# EAGLE design Cansat 2018 V3 (EAGLE 8.6.1)
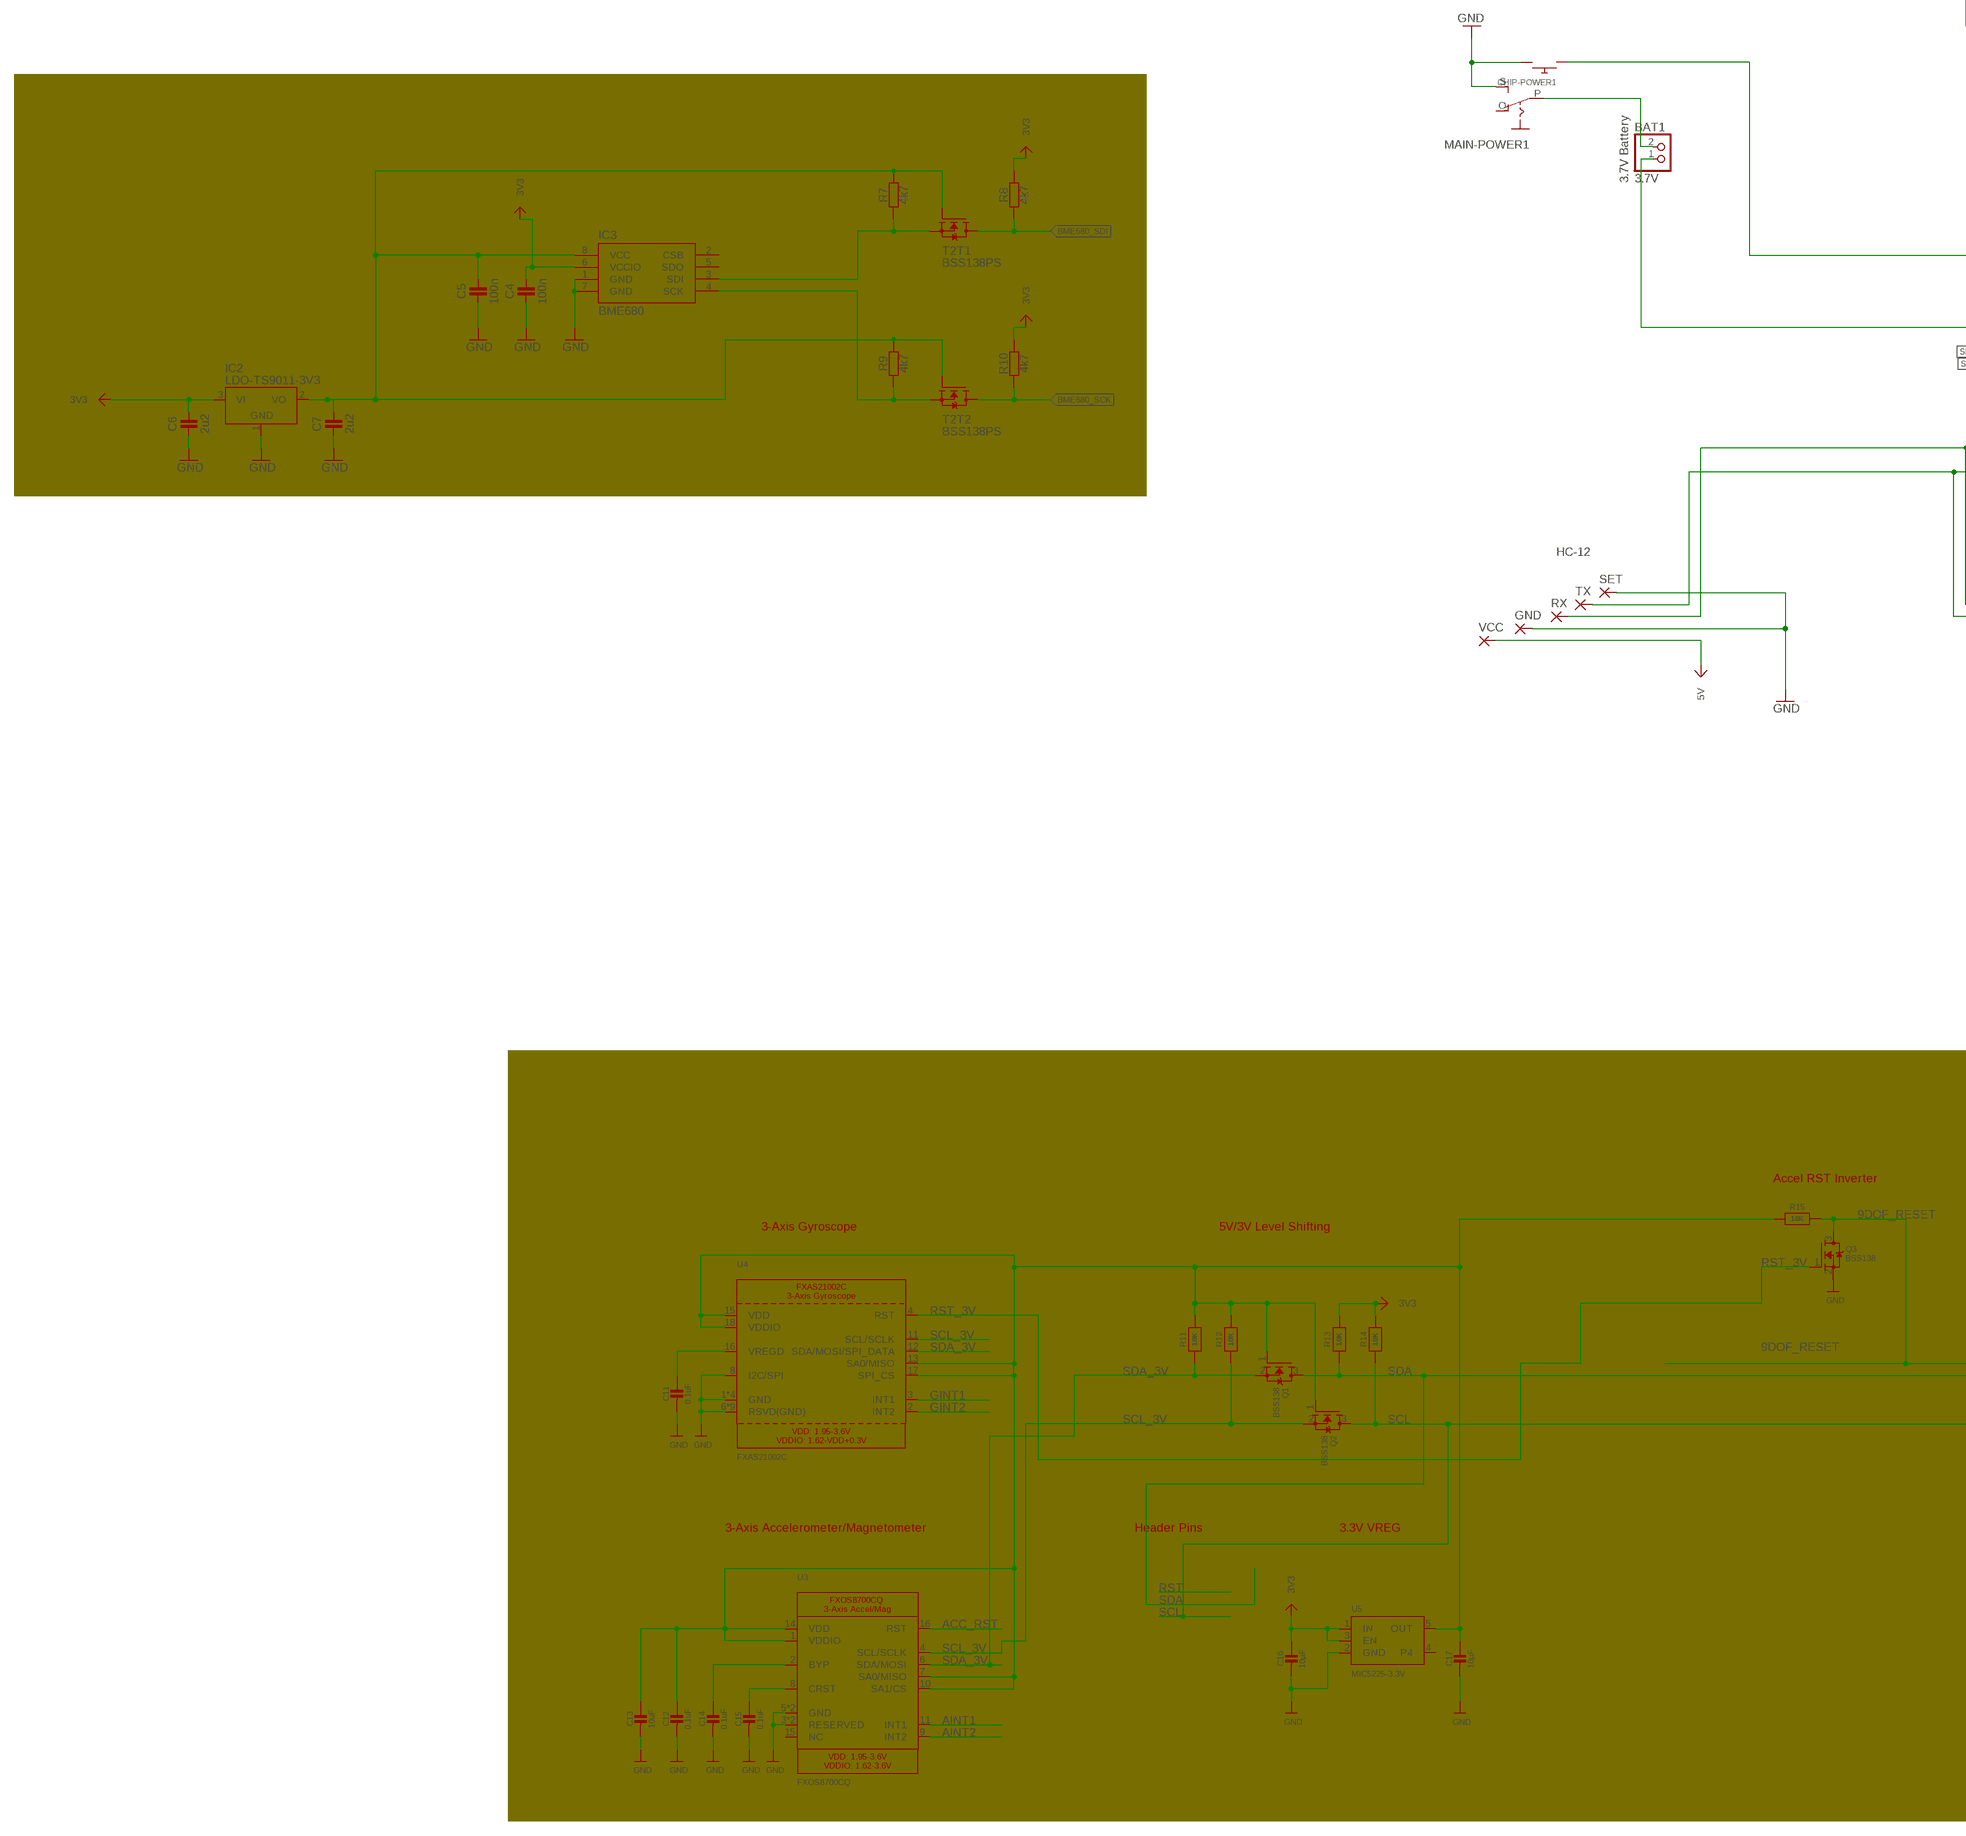
[diagram p0: schematic, sheet 1, part 1 of 3]
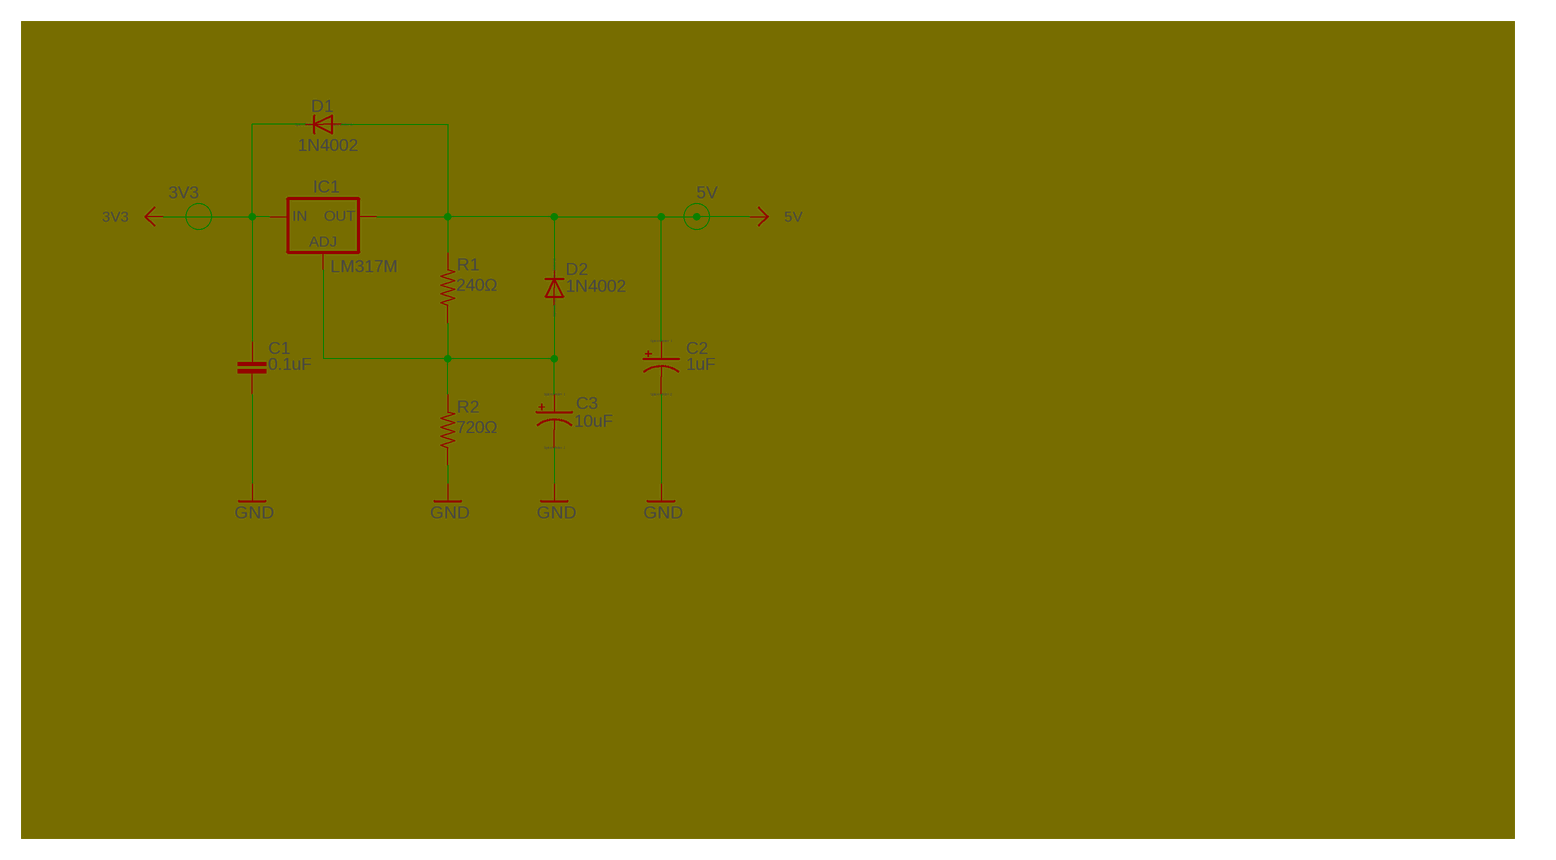
[diagram p1: schematic, sheet 1, part 2 of 3]
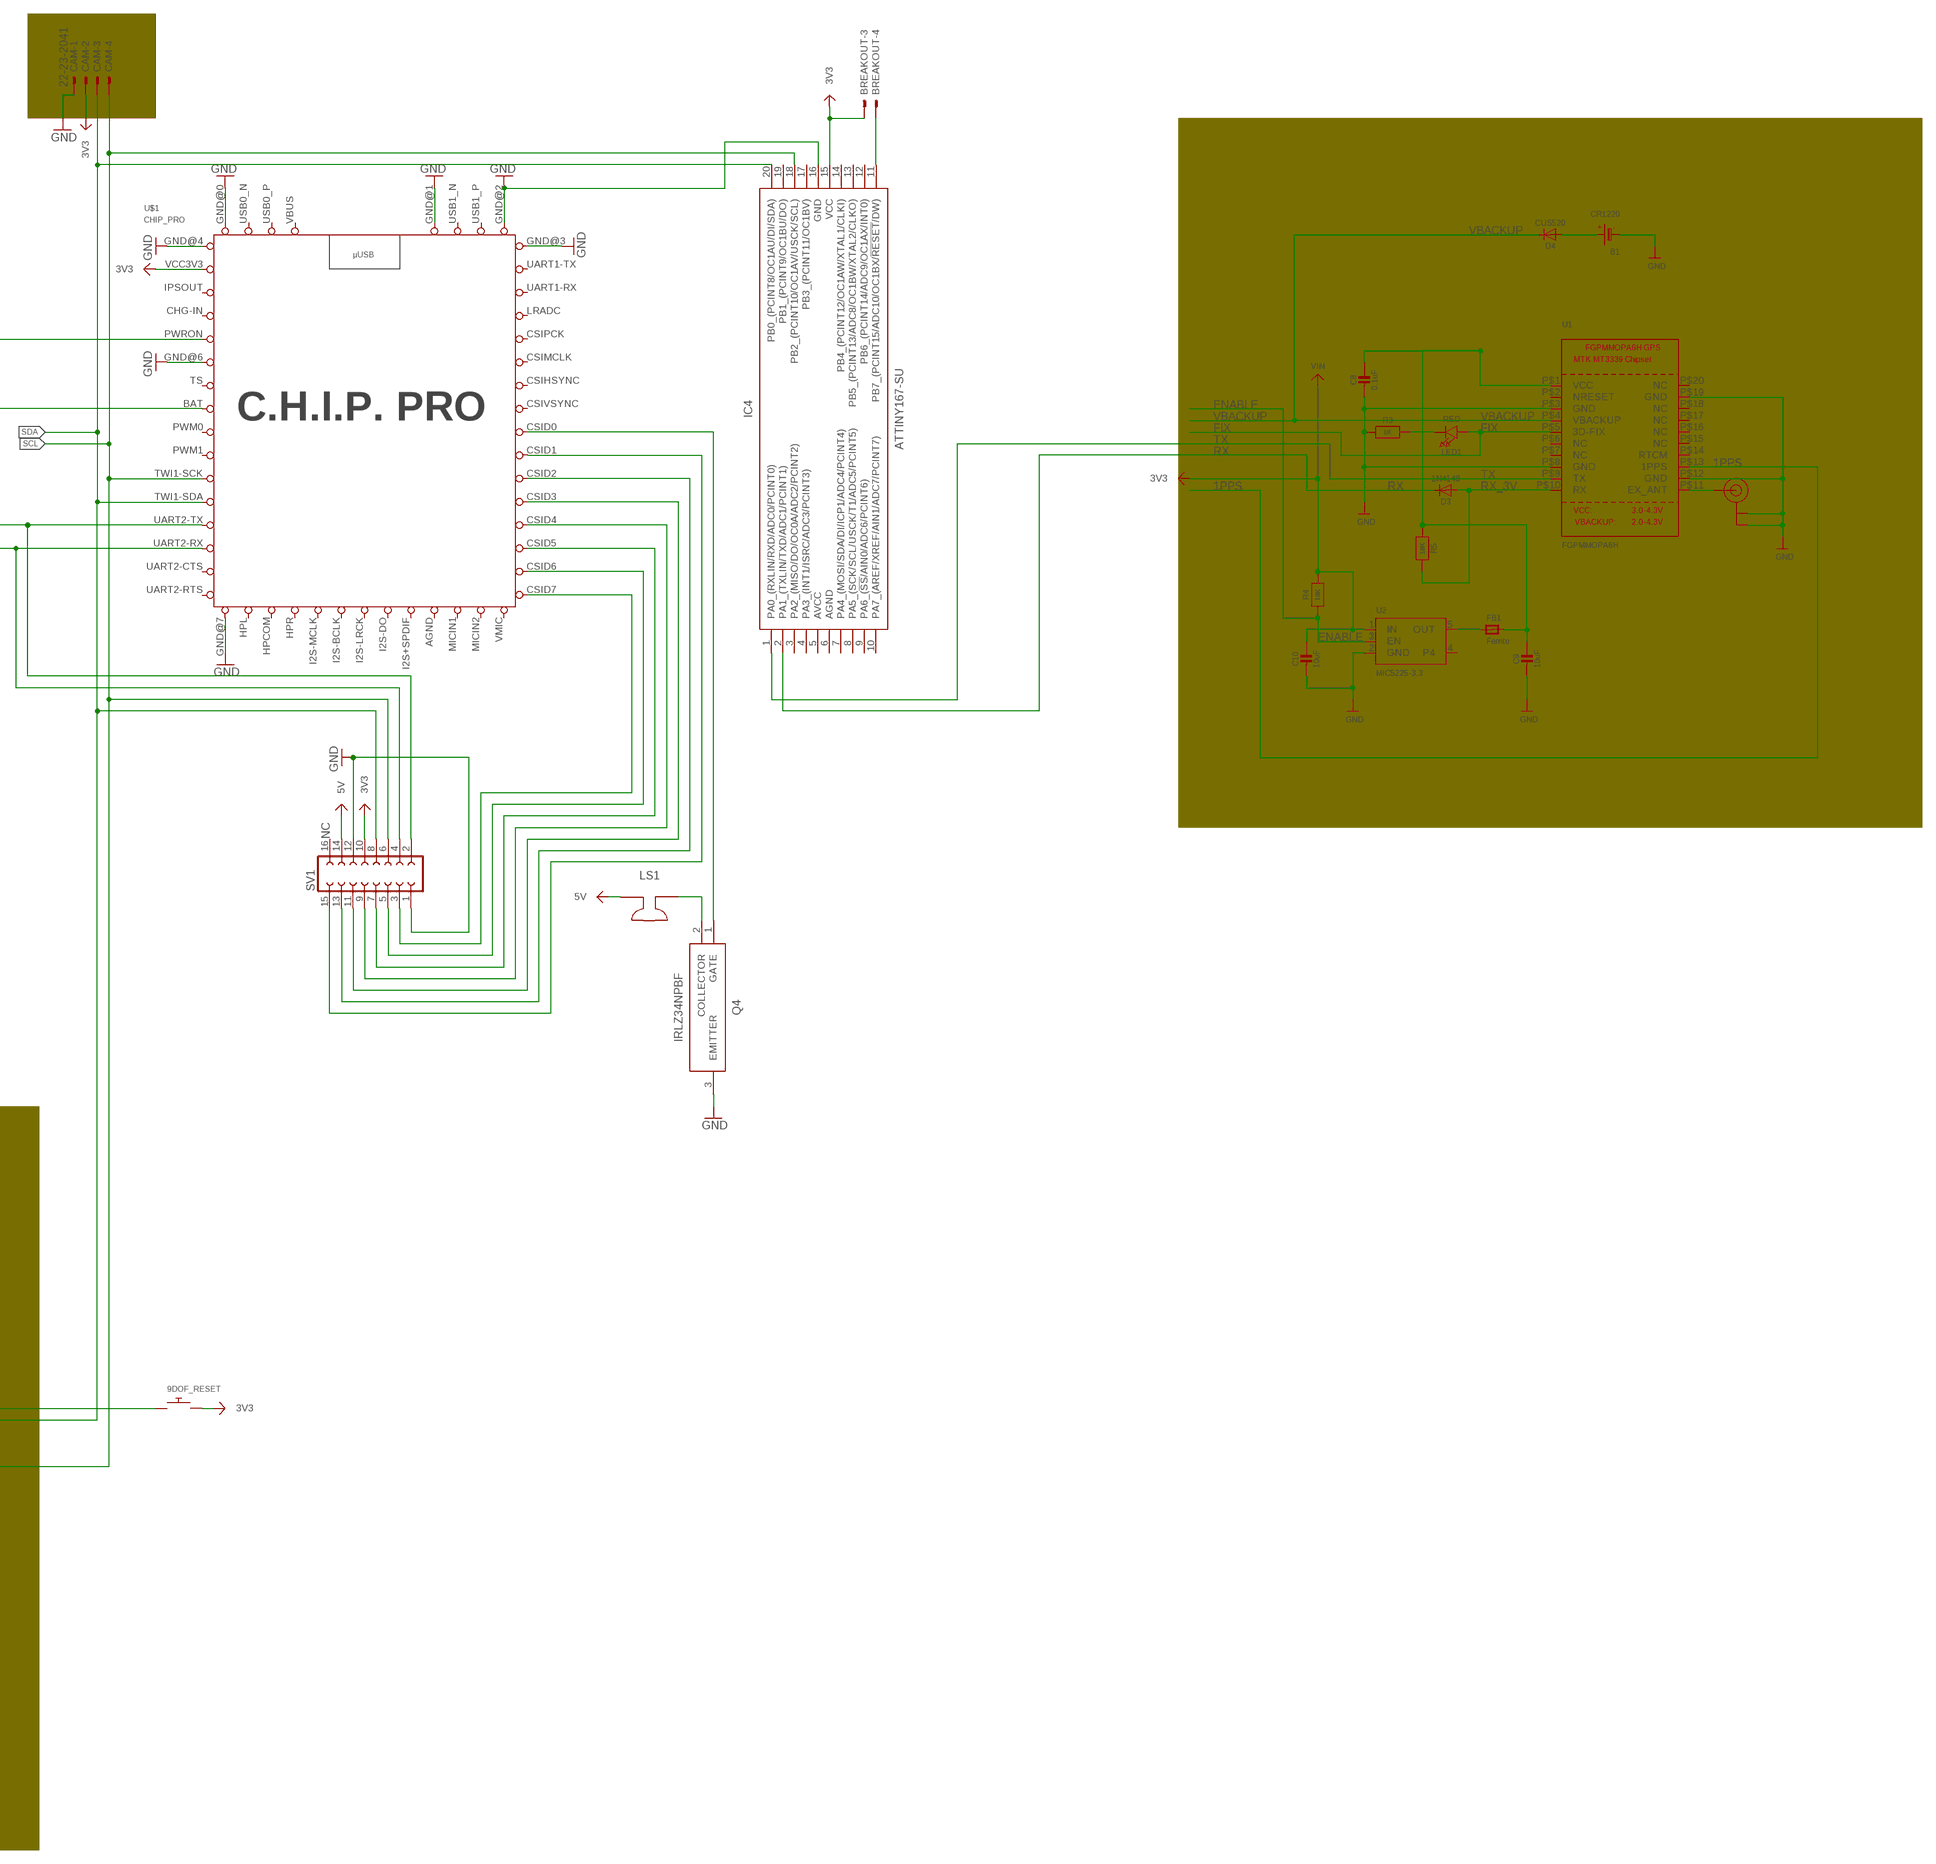
[diagram p2: schematic, sheet 1, part 3 of 3]

## Parts
9DOF_RESET  SWITCH_PUSHBUTTONEVQ-PE  [TACT_PANA-EVQ]
B1  CR1220  BATTERYCR1220_SMT  [CR1220]
BAT1  3.7V  JST_2PIN-THM-RA  [JST-PH-2-THM-RA]
BREAKOUT  22-23-2041  [22-23-2041]
C1  0.1uF  C-EU075-052X106  [C075-052X106]
C2  1uF  CPOL-US085CS-1AR  [085CS_1AR]
C3  10uF  CPOL-US085CS-1AR  [085CS_1AR]
C4  100n  CAPACITOR-0402  [C0402]
C5  100n  CAPACITOR-0402  [C0402]
C6  2u2  CAPACITOR-0402  [C0402]
C7  2u2  CAPACITOR-0402  [C0402]
C8  0.1uF  CAP_CERAMIC0805-NOOUTLINE  [0805-NO]
C9  10uF  CAP_CERAMIC0805-NOOUTLINE  [0805-NO]
C10  10uF  CAP_CERAMIC0805-NOOUTLINE  [0805-NO]
C11  0.1uF  CAP_CERAMIC0805-NOOUTLINE  [0805-NO]
C12  0.1uF  CAP_CERAMIC0805-NOOUTLINE  [0805-NO]
C13  10uF  CAP_CERAMIC0805-NOOUTLINE  [0805-NO]
C14  0.1uF  CAP_CERAMIC0805-NOOUTLINE  [0805-NO]
C15  0.1uF  CAP_CERAMIC0805-NOOUTLINE  [0805-NO]
C16  10µF  CAP_CERAMIC0805-NOOUTLINE  [0805-NO]
C17  10µF  CAP_CERAMIC0805-NOOUTLINE  [0805-NO]
CAM  22-23-2041  [22-23-2041]
CHIP-POWER1  SWITCH_PUSHBUTTONEVQ-PE  [TACT_PANA-EVQ]
D1  1N4002  1N4004  [DO41-10]
D2  1N4002  1N4004  [DO41-10]
D3  1N4148  DIODESOD-323  [SOD-323]
D4  CUS520  DIODESOD-323  [SOD-323]
FB1  Ferrite  FERRITE-0805NO  [0805-NO]
GND  2,15/1,0  [2,15/1,0]
IC1  LM317MBSTT3  [SOT223]
IC2  LDO-TS9011-3V3  [SOT23]
IC3  BME680  [BME680]
IC4  ATTINY167-SU  [SOIC127P1032X265-20N]
LED1  RED  LED0805  [CHIPLED_0805]
LS1  3030161  [CAPPRD650W70D1200H950]
MAIN-POWER1  EG1218S  [EG1218]
Q1  BSS138  MOSFET-NWIDE  [SOT23-WIDE]
Q2  BSS138  MOSFET-NWIDE  [SOT23-WIDE]
Q3  BSS138  MOSFET-NWIDE  [SOT23-WIDE]
Q4  IRLZ34NPBF  [TO254P469X1042X1967-3P]
R1  240Ω  R-US_M0805  [M0805]
R2  720Ω  R-US_M0805  [M0805]
R3  1K  RESISTOR0805_NOOUTLINE  [0805-NO]
R4  10K  RESISTOR0805_NOOUTLINE  [0805-NO]
R5  10K  RESISTOR0805_NOOUTLINE  [0805-NO]
R7  4k7  RESISTOR-0402  [C0402]
R8  4k7  RESISTOR-0402  [C0402]
R9  4k7  RESISTOR-0402  [C0402]
R10  4k7  RESISTOR-0402  [C0402]
R11  10K  RESISTOR0805_NOOUTLINE  [0805-NO]
R12  10K  RESISTOR0805_NOOUTLINE  [0805-NO]
R13  10K  RESISTOR0805_NOOUTLINE  [0805-NO]
R14  10K  RESISTOR0805_NOOUTLINE  [0805-NO]
R15  10K  RESISTOR0805_NOOUTLINE  [0805-NO]
RX  2,15/1,0  [2,15/1,0]
SET  2,15/1,0  [2,15/1,0]
SV1  FE08-2  [FE08-2]
T2  BSS138PS  [SOT363]
TX  2,15/1,0  [2,15/1,0]
U1  FGPMMOPA6H  GPS_FGPMMOPA6H  [FGPMMOPA6H]
U2  MIC5225-3.3  VREG_SOT23-5  [SOT23-5]
U3  FXOS8700CQ  ACCEL_MAG_FXOS8700CQ  [QFN16_3MM_FREESCALE_5X3]
U4  FXAS21002C  GYRO_FXAS21002C  [QFN24_4MM_FREESCALE_7X5]
U5  MIC5225-3.3V  VREG_SOT23-5  [SOT23-5]
U$1  CHIP_PRO  [CHIP_PRO]
U$20  U.FL  [U.FL]
VCC  2,15/1,0  [2,15/1,0]

## Nets
1PPS: U1.P$13(1PPS)
3V3: 9DOF_RESET.P$2 BREAKOUT.3 C1.1 C4.2 C6.2 C10.1 C16.1 CAM.2 D1.C IC1.3(IN) IC2.3(VI) IC3.6(VCCIO) IC4.15(VCC) R4.2 R8.2 R10.2 R13.2 R14.2 SV1.10 U2.1(IN) U5.1(IN) U5.3(EN) U$1.VCC3V3 ; supply symbol labelled VIN
5V: C2.+ D1.A D2.C IC1.4(OUT) LS1.1(+) R1.2 SV1.14 VCC.1(P)
9DOF_RESET: 9DOF_RESET.P$1 Q3.3(D) R15.2
ACC_RST: U3.16(RST)
AINT1: U3.11(INT1)
AINT2: U3.9(INT2)
BME680_LV_SCK: IC3.4(SCK) R9.1 T2.4(T2:S)
BME680_LV_SDI: IC3.3(SDI) R7.1 T2.1(T1:S)
BME680_SCK: R10.1 T2.3(T2:D)
BME680_SDI: R8.1 T2.6(T1:D)
ENABLE: R4.1 U2.3(EN)
FIX: LED1.A U1.P$5(3D-FIX)
GINT1: U4.3(INT1)
GINT2: U4.2(INT2)
GND: B1.- C1.2 C2.- C3.- C4.1 C5.1 C6.1 C7.1 C8.2 C9.2 C10.2 C11.2 C12.2 C13.2 C14.2 C15.2 C16.2 C17.2 CAM.1 CHIP-POWER1.P$2 GND.1(P) IC2.1(GND) IC3.1(GND) IC3.7(GND) IC4.16(GND) MAIN-POWER1.S Q3.2(S) Q4.3(EMITTER) R2.1 R3.1 SET.1(P) SV1.1 SV1.12 U1.P$3(GND) U1.P$8(GND) U1.P$12(GND) U1.P$19(GND) U2.2(GND) U3.3(RESERVED) U3.5(GND) U3.12(GND) U3.13(RESERVED) U4.1(GND) U4.5(GND) U4.6(RSVD(GND)) U4.7(RSVD(GND)) U4.8(I2C/SPI) U4.9(RSVD(GND)) U4.10(RSVD(GND)) U4.14(GND) U4.19(GND) U4.20(RSVD(GND)) U4.21(RSVD(GND)) U4.22(RSVD(GND)) U4.23(RSVD(GND)) U4.24(RSVD(GND)) U5.2(GND) U$1.GND@0(GND) U$1.GND@1(GND) U$1.GND@2(GND) U$1.GND@3(GND) U$1.GND@4(GND) U$1.GND@6(GND) U$1.GND@7(GND) U$20.P$1(GND) U$20.P$2(GND)
N$1: C3.+ D2.A IC1.1(ADJ) R1.1 R2.2
N$2: LED1.C R3.2
N$3: FB1.1 U2.5(OUT)
N$4: SV1.4 TX.1(P) U$1.UART2-RX
N$5: C5.2 C7.2 IC2.2(VO) IC3.8(VCC) R7.2 R9.2 T2.2(T1:G) T2.5(T2:G)
N$6: RX.1(P) SV1.2 U$1.UART2-TX
N$7: B1.+$1(+) B1.+$2(+) D4.A
N$8: C8.1 C9.1 FB1.2 R5.1 U1.P$1(VCC)
N$9: U1.P$11(EX_ANT) U$20.P$3(SIGNAL)
N$10: BREAKOUT.4 IC4.11(PB7_(PCINT15/ADC10/OC1BX/!RESET!/DW))
N$11: C11.1 U4.16(VREGD)
N$12: CHIP-POWER1.P$1 U$1.PWRON
N$14: LS1.2(-) Q4.2(COLLECTOR)
N$15: BAT1.2 MAIN-POWER1.P
N$16: Q4.1(GATE) U$1.CSID0
N$18: SV1.15 U$1.CSID1
N$19: BAT1.1 U$1.BAT
N$20: SV1.13 U$1.CSID2
N$21: SV1.11 U$1.CSID3
N$22: SV1.9 U$1.CSID4
N$23: SV1.7 U$1.CSID5
N$24: C14.1 U3.2(BYP)
N$25: SV1.5 U$1.CSID6
N$26: C15.1 U3.8(CRST)
N$27: SV1.3 U$1.CSID7
OUT: C12.1 C13.1 C17.1 Q1.1(G) Q2.1(G) R11.2 R12.2 R15.1 U3.1(VDDIO) U3.7(SA0/MISO) U3.10(SA1/CS) U3.14(VDD) U4.13(SA0/MISO) U4.15(VDD) U4.17(SPI_CS) U4.18(VDDIO) U5.5(OUT)
RST_3V: Q3.1(G) U4.4(RST)
RX: D3.C IC4.2(PA1_(TXLIN/TXD/ADC1/PCINT1))
RX_3V: D3.A R5.2 U1.P$10(RX)
SCL: CAM.4 IC4.18(PB2_(PCINT10/OC1AV/USCK/SCL)) Q2.3(D) R14.1 SV1.6 U$1.TWI1-SCK
SCL_3V: Q2.2(S) R12.1 U3.4(SCL/SCLK) U4.11(SCL/SCLK)
SDA: CAM.3 IC4.20(PB0_(PCINT8/OC1AU/DI/SDA)) Q1.3(D) R13.1 SV1.8 U$1.TWI1-SDA
SDA_3V: Q1.2(S) R11.1 U3.6(SDA/MOSI) U4.12(SDA/MOSI/SPI_DATA)
TX: IC4.1(PA0_(RXLIN/RXD/ADC0/PCINT0)) U1.P$9(TX)
VBACKUP: D4.C U1.P$4(VBACKUP)
Unconnected: BREAKOUT.1 BREAKOUT.2 IC3.2(CSB) IC3.5(SDO) IC4.3(PA2_(MISO/DO/OC0A/ADC2/PCINT2)) IC4.4(PA3_(INT1/ISRC/ADC3/PCINT3)) IC4.5(AVCC) IC4.7(PA4_(MOSI/SDA/DI/ICP1/ADC4/PCINT4)) IC4.8(PA5_(SCK/SCL/USCK/T1/ADC5/PCINT5)) IC4.9(PA6_(!SS!/AIN0/ADC6/PCINT6)) IC4.10(PA7_(AREF/XREF/AIN1/ADC7/PCINT7)) IC4.12(PB6_(PCINT14/ADC9/OC1AX/INT0)) IC4.13(PB5_(PCINT13/ADC8/OC1BW/XTAL2/CLKO)) IC4.14(PB4_(PCINT12/OC1AW/XTAL1/CLKI)) IC4.17(PB3_(PCINT11/OC1BV)) IC4.19(PB1_(PCINT9/OC1BU/DO)) MAIN-POWER1.O SV1.16 U1.P$2(NRESET) U1.P$6(NC) U1.P$7(NC) U1.P$14(RTCM) U1.P$15(NC) U1.P$16(NC) U1.P$17(NC) U1.P$18(NC) U1.P$20(NC) U2.4 U3.15(NC) U5.4 U$1.CSIHSYNC U$1.CSIMCLK U$1.CSIPCK U$1.CSIVSYNC U$1.HPCOM U$1.HPL U$1.HPR U$1.I2S+SPDIF(I2SSPDIF) U$1.I2S-BCLK(I2SBCLK) U$1.I2S-DO(I2SDO) U$1.I2S-LRCK(I2SLRCK) U$1.I2S-MCLK(I2SMCLK) U$1.LRADC U$1.MICIN1 U$1.MICIN2 U$1.PWM0 U$1.PWM1 U$1.TS U$1.UART1-RX U$1.UART1-TX U$1.UART2-CTS U$1.UART2-RTS U$1.USB0_N U$1.USB0_P U$1.USB1_N U$1.USB1_P U$1.VMIC

## Notes on the sheet
- 5V Voltage Regulator
- 3V to 40V DC | 5V, 500mA
- Vref = 1.25V
- Useful Notes
- C3 helps in ripple rejection upto 15dB
- D1 protect the device against input short circuit
- D2 protect against output short circuit for capacitance discharging
- C2 of 1 µF tantalum capacitor on the output helps to improve transient response
- Camera pins
- GPS
- BME680
- 3.7V Battery
- I2C Address
  open   = 0x77
- D1+R3 restrict RX input to 3.3V
- HC-12
- NC
- 9DOF
- Accel RST Inverter
- 3-Axis Gyroscope | 5V/3V Level Shifting
- Address = 0x21
- 3-Axis Accelerometer/Magnetometer | Header Pins | 3.3V VREG
- Address = 0x1F

## Power pins joined to a net without a drawn wire
AGND: IC4.6(AGND) U$1.AGND
CHG-IN: U$1.CHG-IN
IPSOUT: U$1.IPSOUT
VBUS: U$1.VBUS

## Library data of the parts
9DOF_RESET CHIP-POWER1 = adafruit:SWITCH_PUSHBUTTON: Buttons SOFTTOUCHSMD_SJ - Soft touch temporary push button (Super Junk Akihabara) Compatible with SKPMANE010 [Mouser: 688-SKPMAN] C&K_KSS = Digikey: KSS221GLFS
B1 = microbuilder:BATTERY: CR1220 SMT - Digikey: 3001K-ND CD2032 BAT-HLD-001 - Digikey: BAT-HLD-001-ND
BAT1 = adafruit:JST_2PIN: JST 2-Pin Connectors of various flavors SMT-RA (S2B-PH-SM4) 4UConnector #17311 SMT (B2B-PH-SM4) THM-RA (S2B-PH) THM (B2B-PH)
BREAKOUT CAM = con-molex:22-23-2041: .100" (2.54mm) Center Header - 4 Pin; MF: MOLEX; MPN: 22-23-2041; OC_FARNELL: 1462920; OC_NEWARK: 38C0355
C1 = rcl:C-EU: CAPACITOR, European symbol; SPICEPREFIX: C
C2 C3 = resistor:CPOL-US: POLARIZED CAPACITOR, American symbol
C4-C7 = we-rcl:CAPACITOR: Capacitors ...4.7uF @ 6.3V -> 0402 ...10uF @ 16V -> 0603 ...22uF @ 25V -> 0805
C8-C17 = microbuilder:CAP_CERAMIC: Ceramic Capacitors For new designs, use the packages preceded by an '_' character since they are more reliable: The following footprints should be used on most boards: _0402 - Standard footprint for regular board layouts _0603 - Standard footprint for regular board layouts _0805 - Standard footprint for regular board layouts _1206 - Standard footprint for regular board layouts For extremely tight-pitch boards where space is at a premium, the following 'micro-pitch' footprints can be used (smaller pads, no silkscreen outline, etc.): _0402MP - Micro-pitch footprint for very dense/compact boards _0603MP - Micro-pitch footprint for very dense/compact boards _0805MP - Micro-pitch footprint for very dense/compact boards _1206MP - Micro-pitch footprint for very dense/compact boards
D1 D2 = diode:1N4004: DIODE general purpose rectifier, 1 A
D3 D4 = microbuilder:DIODE: Diode SMA Model Volts Amps Type Vf Ir Digikey # Notes SSA34-E3 40V 3A Schottky 480mV @ 3A 200uA @ 40V SSA34-E3/61TGITR-ND CDBA120-G 20V 1A Schottky 500mV @ 1A 500uA @ 20V 641-1014-6-ND REEL MBRA210 10V 2A Schottky 350mV @ 2A 700uA @ 10V MBRA210LT3 SOD-123 Model Volts Amps Type Vf Ir Order # Notes BAT54T1G 30V 200mA Schottky 800mV @ 200mA 2uA @ 25V BAT54T1GOSTR-ND B0530W 30V 500mA Schottky 430mV @ 500mA 130uA @ 30V B0530W-FDICT-ND REEL MBR120 20V 1A Schottky 340mV @ 1A MBR120VLSFT1GOSCT-ND SOD-323 Model Volts Amps Type Vf Ir Order # Notes PMEG2005EJ 20V 500mA Schottky 355mV @ 500mA 568-4110-1-ND ZLLS410 10V 570mA Schottky 380mV @ 570mA ZLLS410CT-ND 1N4148WS 75V 150mA Silicon/Simple 1V 1N4148WSFSCT-ND REEL SOD-523 Model Volts Amps Type Vf Ir Order # Notes BAT54XV2 30V 200mA Schottky 0.8V @ 100mA BAT54XV2CT-ND TB751S 30V 30mA Schottky RB751S-40TE61CT-ND SOT23-R/W (R = Solder Paste/Reflow Ovens, W = Hand-Soldering) Model Volts Amps Type Vf Ir Order # Notes BAT54FILM 40V 300mA Schottky 497-7162-1-ND POWERDI-5 Model Volts Amps Type Vf Ir Order # Notes PDS560 60V 5A Schottky 670mV @ 5A 150uA @ 60V PDS560DICT-ND
FB1 = microbuilder:FERRITE: Ferrite Bead 0603 MMZ1608B121C - 120 Ohm @ 100MHz, 600mA, 0.15 Ohm DC Resistance - Digikey: 445-2164-1-ND BK1608HW121-T - 120 Ohm, 600mA Ferrite Chip - Digikey: 587-1876-2-ND 0805 HZ0805B272R-10 - 2.7K Ohm @ 100MHz, 200mA, 0.8 Ohm DC Resistance - Digikey: 240-2504-1-ND (see also Murata BLM21BD272SN1L) MMZ2012Y152B - 1.5K Ohm @ 100MHz, 500mA, 0.4 Ohm DC Resistance - Digikey: 445-1560-1-ND - Mainly for high frequency (80-400MHz) MMZ2012R102A - 1K Ohm @ 100MHz, 500mA, 0.3 Ohm DC Resistance - Digikey: 445-1555-2-ND - More general purpose (10-200MHz)
GND RX SET TX VCC = wirepad:2,15/1,0: THROUGH-HOLE PAD
IC1 = v-reg:LM317?*: 500 mA Adjustable Output Positive Voltage Regulator Source: http://www.onsemi.co.jp .. LM317M-D.PDF; PARTNUMBER: LM317M
IC2 = we-power:LDO: LDOs TS1117 800mA, Vin max 12V - compatible NCP1117 1A, Vin max 20V TS9011 250mA, Vin max 12V - compatible AP2210 300mA, Vin max 15V TS5204 150mA, Vin max 16V
IC3 = we-sensor:BME680: Bosch BME280 Humidity, Pressure, Air Quality Sensor
IC4 = SamacSys_Parts:ATTINY167-SU: Atmel ATTINY167-SU, 8bit AVR Microcontroller, 20MHz, 16 kB Flash, 20-Pin SOIC <https://componentsearchengine.com/Images/3/ATTINY167-SU.jpg> Source: Datasheet <http://docs-europe.electrocomponents.com/webdocs/0fa2/0900766b80fa26b5.pdf>; DESCRIPTION: Atmel ATTINY167-SU, 8bit AVR Microcontroller, 20MHz, 16 kB Flash, 20-Pin SOIC; HEIGHT: 2.65mm; MANUFACTURER_NAME: Microchip; MANUFACTURER_PART_NUMBER: ATTINY167-SU; RS_PART_NUMBER: 1330967; SUPPLIER_NAME: RS
LED1 = microbuilder:LED: LED 0603 - 0603 Surface Mount Package 2mA: Green LED - Low Power (3.9mcd, 2ma, 1.7Vf) - Digikey: 475-2709-2-ND Orange LED - Low Power (9.8mcd, 2ma, 1.8Vf) - Digikey: 475-1194-2-ND Red LED - Low Power (5mcd, 2ma, 1.8Vf) - Digikey: 475-1195-2-ND Yellow LED - Low Power (7mcd, 2ma, 1.8Vf) - Digikey: 475-1196-2-ND 5mA: Blue LED - Low Power (17mcd, 5ma, 2.9Vf) - Digikey: LNJ937W8CRACT-ND 0805 - 0805 Surface Mount Package 2mA: Red LED (8.8mcd, 2mA, 1.8Vf, Clear) - Low Power [Digikey: 475-2510-1-ND] Green LED (5mcd, 2mA, 1.8Vf, Clear) - Low Power [Digikey: 475-2730-1-ND] Yellow LED (11.3mcd, 2mA, 1.8Vf, Clear) - Low Power [Digikey: 475-2555-1-ND] 20mA: Red LED (104mcd, 20mA, Diffused) - LS R976 [Digikey: 475-1278-6-ND] Red LED (12mcd, 20mA, 2.0Vf, Clear) - APT2012EC [Digikey: 754-1128-1-ND] Green LED (15mcd, 20mA, 2.2Vf, Clear) - APT2012GC [Digikey: 754-1131-1-ND] Orange LED (160mcd, 20mA, 2.1Vf, Clear) - APT2012SECK [Digikey: 754-1130-1-ND] 1206 - 1206 Surface Mount Package Green LED (26mcd, 20mA, Diffused) - LG N971 [Digikey: 475-1407-6-ND] Red LED (15mcd, 20mA, Diffused) - LH N974 [Digikey: 475-1416-6-ND] Cree - Cree High-Power Surface Mount LEDs XPEBWT-L1-0000-00D50 - White 111lm 350mA 2.9Vf 6200K 110° XTEAWT-00-0000-00000LEE3 - White 114lm 350mA 2.85Vf 5000K 115° Everlight - Everlight 45-21 Series Surface Mount LEDs 45-21/QK2C-B2832AC2CB2/2T - Warm White 2000mcd 20mA 3.25Vf 3050K 120° 45-21/LK2C-B38452C4CB2/2T - Nuetral White 2000mcd 20mA 3.25Vf 4150K 120° 45-21/LK2C-B50634C6CB2/2T - Cold White 2200mcd 20mA 3.25Vf 5650K 120° PLCC2 Reverse Mount LS T77K-J1L2-1-0-2-R18-Z - Red 11.25mcd 2mA 1.8Vf 630nm 120° LO T77K-L1M2-24-Z - Orange 19.6mcd 2mA 1.8Vf 606nm 120° LY T77K-K2M1-26-Z - Yellow 15.7mcd 2mA 1.8Vf 587nm 120°
LS1 = SamacSys_Parts:3030161: RS Pro 8V Magnetic Buzzer, 92dB Continuous <http://uk.rs-online.com/largeimages/F3030161-01.jpg> Source: Datasheet <http://docs-europe.electrocomponents.com/webdocs/121d/0900766b8121dc4a.pdf>; DESCRIPTION: RS Pro 8V Magnetic Buzzer, 92dB Continuous; HEIGHT: 9.5mm; MANUFACTURER_NAME: RS Components; MANUFACTURER_PART_NUMBER: 3030161; RS_PART_NUMBER: 3030161; SUPPLIER_NAME: RS
MAIN-POWER1 = adafruit:EG1218: SLIDING SWITCH 0.1" spacing through hole, vertical SPDT slide switch http://www.ladyada.net/library/pcb/eaglelibrary.html
Q1-Q3 = microbuilder:MOSFET-N: N-Channel Mosfet LEGEND VDS: Voltage Drain-Source ID: Drain Current RDS(ON): Drain-Source On-State Resistance VGS(TH): Gate-Source Threshold Voltage CISS: Drain-Source Input Capacitance SOT-23 Name VDS ID RDS(ON) VGS(TH) CISS Order Number 2N7002E 60V 260mA 2.5 Ohm 2.5V @ 250uA 26.7pF @ 25V 2N7002ET1GOSTR-ND BSH103 30V 850mA 400 mOhm 400mV @ 1mA 83pF @ 24V BSH103,235-ND BSS138 60V 320mA 1.6 Ohm 1.5V @ 250uA 50pF @ 10V Mouser: 771-BSS138PW115 DMN2075U-7 20V 4.2A 38 mOhm 1V @ 250 uA 594.3pF @ 10V DMN2075U-7DICT-ND * BSS138 good choice for I2C level-shifting POWERPAK 1212-8 Name VDS ID RDS(ON) VGS(TH) CISS Order Number Si7308DN 60V 6A 58 mOhm 3V @ 250uA 665pF @ 15V SI7308DN-T1-E3CT-ND
Q4 = SamacSys_Parts:IRLZ34NPBF: N-channel MOSFET,IRLZ34N 30A 55V <https://componentsearchengine.com/Images/3/IRLZ34NPBF.jpg> Source: Datasheet <http://docs-europe.electrocomponents.com/webdocs/0791/0900766b807913d5.pdf>; ALLIED_NUMBER: 70017120; DESCRIPTION: N-channel MOSFET,IRLZ34N 30A 55V; HEIGHT: 4.69mm; MANUFACTURER_NAME: International Rectifier; MANUFACTURER_PART_NUMBER: IRLZ34NPBF; RS_PART_NUMBER: 2509061391; SUPPLIER_NAME: RS
R1 R2 = resistor:R-US_: RESISTOR, American symbol
R3-R5 R11-R15 = microbuilder:RESISTOR: Resistors
R7-R10 = we-rcl:RESISTOR: Resistors
SV1 = con-lsta:FE08-2: FEMALE HEADER; OC_FARNELL: unknown; OC_NEWARK: unknown
T2 = we-transistor:BSS138PS: BSS138 Dual N-Channel MOSFET (UGS +/-20V, RDS 1Ohm, ID 320mA)
U1 = microbuilder:GPS_FGPMMOPA6H: GPS Module - MTK MT3339 Chipset, -165dBm sensitivity, 22 channels, 10Hz, auto-select external antenna options
U2 U5 = microbuilder:VREG_SOT23-5: SOT23-5 Fixed Voltage Regulators Part Current Out V Out V In V Dropout θJA (°C/W) TJ (°C) Digikey Part No. ADP121 150mA 3.3V 3.4-5.5V 0.09V @ 150mA -- -- ADP121-AUJZ33R7CT-ND ADP121 150mA 3.0V 3.1-5.5V 0.09V @ 150mA -- -- ADP121-AUJZ30R7CT-ND ADP122 300mA 3.3V 3.4-5.5V 0.085V @ 300mA -- -- ADP122AUJZ-3.3-R7CT-ND ADP1712 300mA 3.3V 3.5-5.5V 0.17V @ 300mA -- -- ADP1712AUJZ-3.3-R7TR-ND AP7311 (Low Cost) 150mA 3.3V 3.5-6V 0.15V @ 150mA -- -- AP7311-33WG-7DICT-ND LD39015M18R 150mA 1.8V 1.9V-5.5V 0.08V @ 100mA -- -- 497-6977-1-ND LP2985A-33DBVR 150mA 3.3V 3.3-16V 0.28V @ 150mA 206 150 296-18479-1-ND MCP1824T-3302E/OT 300mA 3.3V 3.5V-6V 0.2V @ 300mA -- -- MCP1824T-3302E/OTCT-ND MIC5205-2.5YM5 TR 150mA 2.5V 2.7-16V 0.165V @ 150mA -- -- 576-1257-2-ND MIC5205-3.0YM5 TR 150mA 3.0V 3.2V-16V 0.165V @ 150mA -- -- 576-1258-2-ND MIC5205-3.3YM5 TR 150mA 3.3V 3.5V-16V 0.165V @ 150mA -- -- 576-1259-2-ND TPS780330220 150mA 3.3V+2.2V 3.6-5.5V 250mV Max -- -- 296-23332-1-ND TDA3663/N1,135 100mA 3.3V 3.5-45V 0.18V @ 50mA -- -- 568-5343-1-ND Max operating temp can be calculated using θJA, TJ (max junction temperature), and power in watts. Set the "Maximum Ambient Temperature" until it reaches TJ ("Max Junction Temperature"), which is the absolute limit for safe use of the regulator: Heat Sink Temperature Calculator <http://www.daycounter.com/Calculators/Heat-Sink-Temperature-Calculator.phtml> For example, With 12V source into a 3.3V LP2985 and a 30mA load, we are dissipating (12V-3.3V) * 0.03A = 0.261W. With a θJA of 206 °C/W, a TJ of 150°C, and 261mW we can safely use the chip without a heat sink up to 75°C (=147.1°C Junction Temperature).
U3 = microbuilder:ACCEL_MAG_FXOS8700CQ: FX0S8700CQ - 3-Axis Accelerometer and Magnetometer Accel Range: +/-2/4/8 g Accel Data Rate: 1.6-800Hz (400Hz in hybrid mode) Accel Resolution: 14-bits Mag Range: 1200uT Mag Data Rate: 1.6-800Hz (400Hz in hybrid mode) Mag Resolution: 16-bits
U4 = microbuilder:GYRO_FXAS21002C: FXAS21002C - 3 Axis Gyroscope - 250/500/1000/2000dps Range: 250/500/1000/2000 dps Data Rate: 2.5-800Hz Resolution: 16-bits
U$1 = CHIP_Pro-Footprint:CHIP_PRO
U$20 = microbuilder:U.FL: U.FL Antenna Connector

## Board
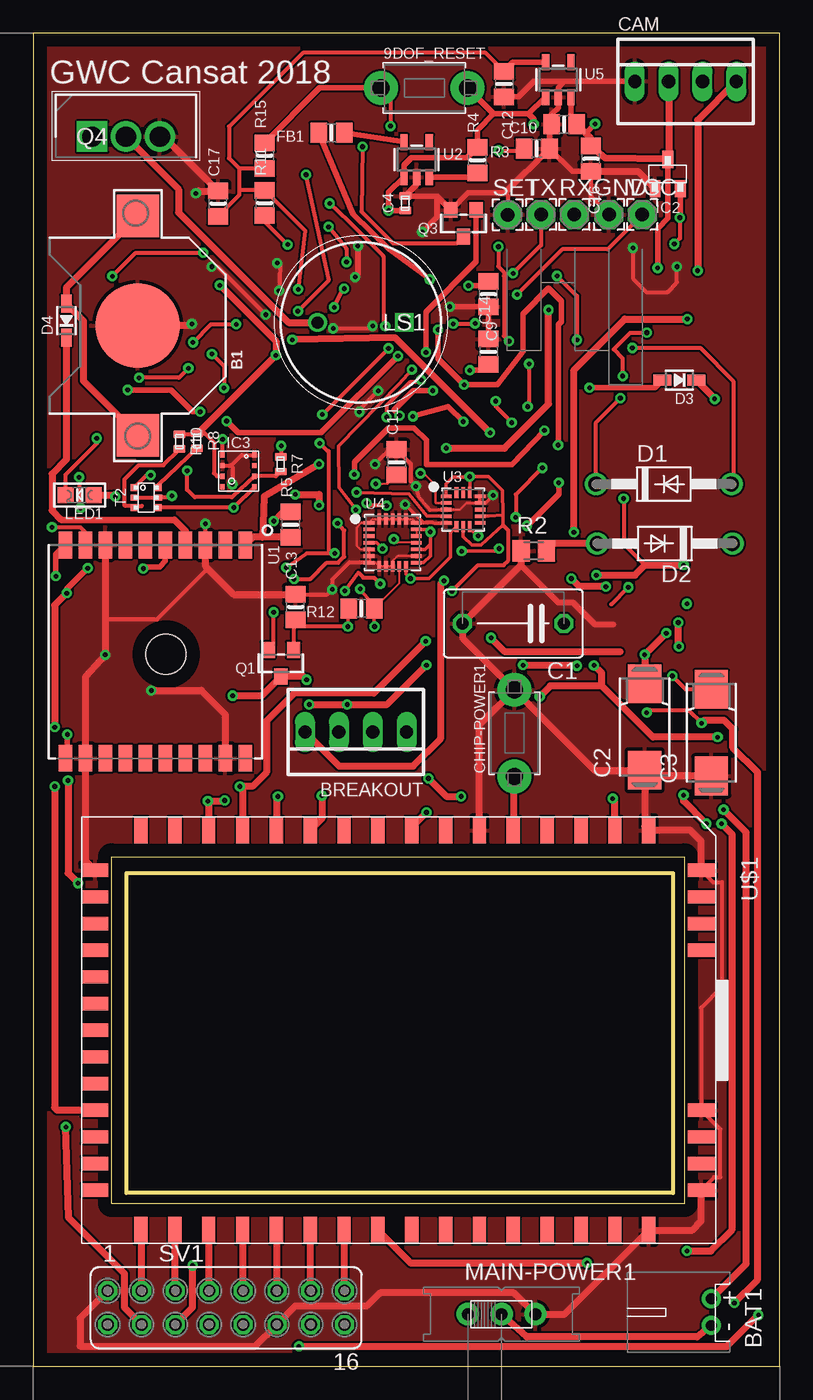
[diagram p3: board, top side]
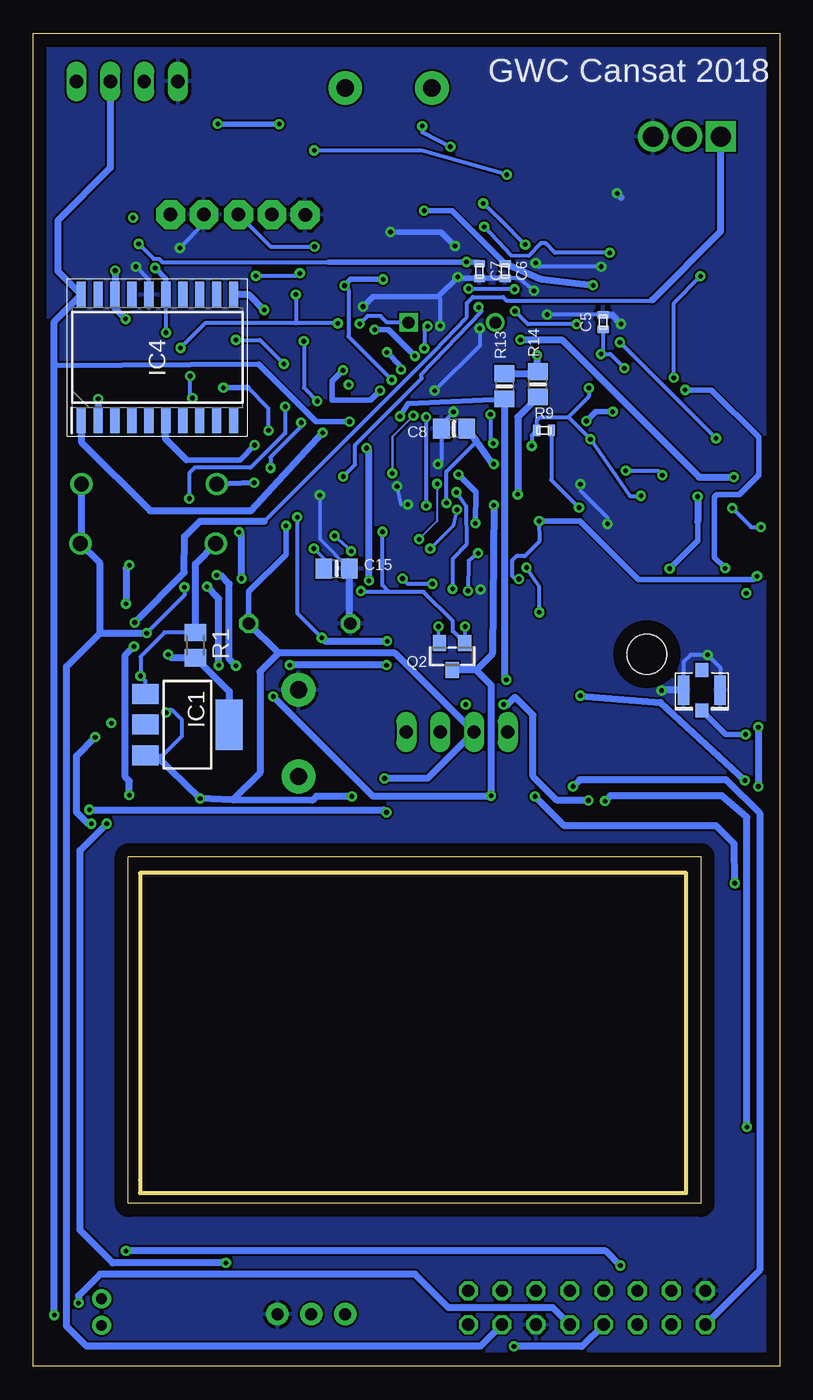
[diagram p4: board, bottom side, seen from below]

Size 56 x 100 mm. Coordinates in mm from the lower left corner, seen from the top.
Outline: 0,0 56,0 56,100 0,100 0,0
Copper layers (1*16): Top 0.035mm / dielectric 1.5mm / Bottom 0.035mm
Design rules "default": minimum track width 6mil, minimum drill 0.35mm, track to track 6mil, track to pad 6mil, pad to pad 6mil, via to via 6mil, smd to smd 6mil, copper to edge 40mil, drill to drill 6mil, minimum pad ring 10mil, minimum via ring 8mil, stop-mask expansion 4mil, vias tented up to drill 0mil, thermal gap 10mil

### Footprints (pad centres in the part's own frame; a part is rotated, then mirrored left to right if it is on the bottom)
TACT_PANA-EVQ = drill 1.3 pad 2.54: P$1 -3.25,0; P$2 3.25,0
CR1220 = smd 3.2 x 3.2: +$1 -8.225,0; +$2 8.225,0 | smd 6.35 x 6.35: - 0,0
JST-PH-2-THM-RA = drill 0.8 pad 1.422: 1 1,0; 2 -1,0
22-23-2041 = drill 1 long: 1 -3.81,0; 2 -1.27,0; 3 1.27,0; 4 3.81,0
C075-052X106 = drill 0.914 octagon: 1 -3.81,0; 2 3.81,0
085CS_1AR = smd 2.9 x 2.5: + 3.25,0; - -3.25,0
C0402 = smd 0.9 x 0.6: 1 0,0.55; 2 0,-0.55
0805-NO = smd 1.24 x 1.5: 1 -0.95,0; 2 0.95,0
DO41-10 = drill 1.118: A 5.08,0; C -5.08,0
SOD-323 = smd 1.35 x 0.8: A 1.27,0; C -1.27,0
2,15/1,0 = drill 1.016 pad 2.159 octagon: 1 0,0
SOT223 = smd 1.5 x 2: 1 -2.3,-3.15; 2 0,-3.15; 3 2.3,-3.15 | smd 3.8 x 2: 4 0,3.15
SOT23 = smd 1.3 x 0.9: 1 -1.1,0.95; 2 -1.1,-0.95; 3 1.1,0
BME680 = smd 0.4 x 0.4: 1 1.2,1.2; 2 1.2,0.4; 3 1.2,-0.4; 4 1.2,-1.2; 5 -1.2,-1.2; 6 -1.2,-0.4; 7 -1.2,0.4; 8 -1.2,1.2
SOIC127P1032X265-20N = smd 1.925 x 0.7: 1 -4.712,5.715; 2 -4.712,4.445; 3 -4.712,3.175; 4 -4.712,1.905; 5 -4.712,0.635; 6 -4.712,-0.635; 7 -4.712,-1.905; 8 -4.712,-3.175; 9 -4.712,-4.445; 10 -4.712,-5.715; 11 4.712,-5.715; 12 4.712,-4.445; 13 4.712,-3.175; 14 4.712,-1.905; 15 4.712,-0.635; 16 4.712,0.635; 17 4.712,1.905; 18 4.712,3.175; 19 4.712,4.445; 20 4.712,5.715
CHIPLED_0805 = smd 1.2 x 1.2: A 0,-1.05; C 0,1.05
CAPPRD650W70D1200H950 = drill 0.9 pad 1.35 square: 1 0,0 | drill 0.9 pad 1.35: 2 6.5,0
EG1218 = drill 0.9 pad 1.676: O -2.54,0; P 0,0; S 2.54,0
SOT23-WIDE = smd 1 x 1.2: 1 -0.95,-1; 2 0.95,-1; 3 0,1
TO254P469X1042X1967-3P = drill 1.52 pad 2.28 square: 1 0,0 | drill 1.52 pad 2.28: 2 2.54,0; 3 5.08,0
M0805 = smd 1.3 x 1.6: 1 -0.95,0; 2 0.95,0
FE08-2 = drill 0.914 octagon: 1 -8.89,1.27; 2 -8.89,-1.27; 3 -6.35,1.27; 4 -6.35,-1.27; 5 -3.81,1.27; 6 -3.81,-1.27; 7 -1.27,1.27; 8 -1.27,-1.27; 9 1.27,1.27; 10 1.27,-1.27; 11 3.81,1.27; 12 3.81,-1.27; 13 6.35,1.27; 14 6.35,-1.27; 15 8.89,1.27; 16 8.89,-1.27
SOT363 = smd 0.6 x 0.5: 1 -0.9,0.75; 3 -0.9,-0.75; 4 0.9,-0.75; 6 0.9,0.75 | smd 0.6 x 0.4: 2 -0.9,0; 5 0.9,0
FGPMMOPA6H = smd 2 x 1: P$1 -8,6.75; P$2 -8,5.25; P$3 -8,3.75; P$4 -8,2.25; P$5 -8,0.75; P$6 -8,-0.75; P$7 -8,-2.25; P$8 -8,-3.75; P$9 -8,-5.25; P$10 -8,-6.75; P$11 8,-6.75; P$12 8,-5.25; P$13 8,-3.75; P$14 8,-2.25; P$15 8,-0.75; P$16 8,0.75; P$17 8,2.25; P$18 8,3.75; P$19 8,5.25; P$20 8,6.75 | hole 3: 0.2,0.8
SOT23-5 = smd 0.55 x 1.2: 1 -0.95,-1.3; 2 0,-1.3; 3 0.95,-1.3; 4 0.95,1.3; 5 -0.95,1.3
QFN16_3MM_FREESCALE_5X3 = smd 0.8 x 0.275: 1 -1.275,1; 2 -1.275,0.5; 3 -1.275,0; 4 -1.275,-0.5; 5 -1.275,-1; 9 1.275,-1; 10 1.275,-0.5; 11 1.275,0; 12 1.275,0.5; 13 1.275,1 | smd 0.275 x 0.8: 6 -0.5,-1.275; 7 0,-1.275; 8 0.5,-1.275; 14 0.5,1.275; 15 0,1.275; 16 -0.5,1.275
QFN24_4MM_FREESCALE_7X5 = smd 0.8 x 0.275: 1 -1.775,1.5; 2 -1.775,1; 3 -1.775,0.5; 4 -1.775,0; 5 -1.775,-0.5; 6 -1.775,-1; 7 -1.775,-1.5; 13 1.775,-1.5; 14 1.775,-1; 15 1.775,-0.5; 16 1.775,0; 17 1.775,0.5; 18 1.775,1; 19 1.775,1.5 | smd 0.275 x 0.8: 8 -1,-1.775; 9 -0.5,-1.775; 10 0,-1.775; 11 0.5,-1.775; 12 1,-1.775; 20 1,1.775; 21 0.5,1.775; 22 0,1.775; 23 -0.5,1.775; 24 -1,1.775
CHIP_PRO = smd 1 x 2: AGND 6,-22.5; GND@1 -12,-22.5; GND@4 -12,23; GND@6 6,23; GND@7 12,23; HPCOM -8,-22.5; HPL -10,-22.5; HPR -6,-22.5; I2S+SPDIF 4,-22.5; I2S-BCLK -2,-22.5; I2S-DO 2,-22.5; I2S-LRCK 0,-22.5; I2S-MCLK -4,-22.5; MICIN1 8,-22.5; MICIN2 10,-22.5; USB0_N -10,23; USB0_P -8,23; USB1_N 8,23; USB1_P 10,23; VBUS -6,23; VMIC 12,-22.5 | smd 2 x 1: BAT -15,1.27; CHG-IN -15,11.43; CSID0 15,-1.27; CSID1 15,-3.81; CSID2 15,-6.35; CSID3 15,-8.89; CSID4 15,-11.43; CSID5 15,-13.97; CSID6 15,-16.51; CSID7 15,-19.05; CSIHSYNC 15,3.81; CSIMCLK 15,6.35; CSIPCK 15,8.89; CSIVSYNC 15,1.27; GND@0 15,19.05; GND@2 -15,6.35; GND@3 -15,19.05; IPSOUT -15,13.97; LRADC 15,11.43; PWM0 -15,-1.27; PWM1 -15,-3.81; PWRON -15,8.89; TS -15,3.81; TWI1-SCK -15,-6.35; TWI1-SDA -15,-8.89; UART1-RX 15,13.97; UART1-TX 15,16.51; UART2-CTS -15,-16.51; UART2-RTS -15,-19.05; UART2-RX -15,-13.97; UART2-TX -15,-11.43; VCC3V3 -15,16.51
U.FL = smd 2.2 x 0.85: P$1 0,1.375; P$2 0,-1.375 | smd 1.05 x 1: P$3 1.525,0; P$4 -1.525,0

### Placement (x,y rotation side)
9DOF_RESET  29.34,95.9 0 top
B1  7.84,78.07 90 top
BAT1  50.88,4.06 90 top
BREAKOUT  24.2,47.58 180 top
C1  36.02,55.72 180 top
C2  45.88,47.96 90 top
C3  50.88,47.53 90 top
C4  27.91,87.25 0 top
C5  13.24,78.33 0 bottom
C6  20.6,82.17 180 bottom
C7  22.52,82.17 180 bottom
C8  24.42,70.36 180 bottom
C9  34.14,80.43 270 top
C10  39.84,93.17 180 top
C11  27.26,67.82 90 top
C12  35.33,96.19 270 top
C13  19.67,56.96 90 top
C14  34.17,76.11 90 top
C15  33.24,59.83 0 bottom
C16  41.83,90.59 270 top
C17  13.86,87.22 90 top
CAM  48.95,96.39 0 top
CHIP-POWER1  36.1,47.5 90 top
D1  47.31,66.18 0 top
D2  47.39,61.72 180 top
D3  48.48,73.98 180 top
D4  2.48,78.44 90 top
FB1  22.37,92.53 180 top
GND  43.2,86.4 0 top
IC1  44.45,48.13 270 bottom
IC2  47.61,89.44 90 top
IC3  15.39,67.17 0 top
IC4  46.69,75.68 90 bottom
LED1  3.48,65.36 90 top
LS1  27.83,78.31 180 top
MAIN-POWER1  35.14,3.9 0 top
Q1  18.58,52.75 180 top
Q2  24.57,53.25 180 bottom
Q3  32.28,85.75 180 top
Q4  4.41,92.25 0 top
R1  43.83,54.1 270 bottom
R2  37.55,61.17 0 top
R3  37.78,91.36 180 top
R4  33.32,90.49 90 top
R5  19.32,63.14 90 top
R7  18.56,67.67 180 top
R8  12.29,69.42 180 top
R9  17.67,70.22 270 bottom
R10  10.97,69.37 180 top
R11  17.36,87.27 90 top
R12  24.63,56.86 180 top
R13  20.64,73.52 90 bottom
R14  18.14,73.67 90 bottom
R15  17.36,90.82 90 top
RX  40.6,86.4 0 top
SET  35.6,86.38 0 top
SV1  14.47,4.39 0 top
T2  8.47,65.17 0 top
TX  38.1,86.4 0 top
U1  9.16,53.61 270 top
U2  28.77,90.52 0 top
U3  32.25,64.27 0 top
U4  26.97,61.78 0 top
U5  39.39,96.52 0 top
U$1  27.13,25.21 270 top
U$20  5.83,50.72 270 bottom
VCC  45.7,86.4 0 top

### Tracks (layer width: path | path; a pad name or v marks a point on that pad's centre or on a via)
3V3  (via drill 0.35)
  Top 0.305: R8.2 12.45,69.97 | 12.45,69.97 12.88,69.97 13.55,69.3 13.55,67 13.78,66.77 IC3.6 | R10.2 12.4,69.92 12.45,69.97 | D1.C 42.23,70.8 v44.06,72.63 | v44.23,74.28 44.23,75.61 43.55,76.29 44.8,77.54 v46.04,77.54 | v46.03,49.04 46.24,49.25 49.15,49.25 v50.15,48.25
  Top 0.406: 9DOF_RESET.P$2 34.54,93.95 | 37.17,93.95 U5.1 | 34.54,93.95 37.17,93.95 | U5.3 40.34,93.62 C10.1 | 37.17,93.95 37.55,93.57 v37.55,93.19 | v42.16,93.21 41.49,92.55 41.49,92.47 | 34.54,93.95 33.32,92.73 R4.2 32.55,90.67 28.37,90.67 27.82,90.12 U2.1 26.67,88.07 v26.67,86.69 C4.2 | v37.04,63.05 39.43,65.44 v39.43,66.28 | IC2.3 47.61,86.12 46.85,85.36 v46.85,82.4
  Top 0.508: U$1.VCC3V3 43.64,42.36 v43.48,42.59 | v14,81.1 18.2,76.9 v18.2,75.85 12.32,69.97 R8.2 | v29.65,44.1 31,42.75 v32.1,42.75 | v52.6,4.75 54.35,6.5 54.35,44.55 52.5,46.4 52.5,47.8 51.85,48.45 50.35,48.45 v50.15,48.25 | C10.1 41.49,92.47 41.83,92.13 C16.1 42.93,90.64 IC2.3 47.68,90.61 CAM.2
  Bottom 0.305: v44.06,72.63 44.23,72.8 v44.23,74.28 | v46.04,77.54 46.04,80.62 46.05,80.64 | IC1.3 46.29,45.83 44.85,47.27 44.85,48.48 45.59,49.22 45.85,49.22 v46.03,49.04
  Bottom 0.406: v37.55,93.19 42.14,93.19 v42.16,93.21 | C1.1 39.83,58.12 37.04,60.91 v37.04,63.05 | v39.43,66.28 D1.C | v46.85,82.4 46.05,81.61 46.05,80.64 IC4.15 | C6.2 24.57,86.69 v26.67,86.69
  Bottom 0.508: 37.61,53.5 C1.1 | 37.61,53.5 28.85,53.5 BREAKOUT.3 26.41,44.1 v29.65,44.1 | 37.61,53.5 39,52.11 39,44.5 41.05,42.5 | 41.05,42.5 v43.48,42.59 46.83,45.83 IC1.3 47.73,45.83 | C6.2 18.3,81.72 17.82,81.54 v14,81.1 | v18.2,75.85 18.2,74.68 R14.2 18.29,74.47 R13.2 | v32.1,42.75 34.75,42.75 35.05,42.45 41.05,42.5 | 41.05,42.5 41,42.5 | SV1.10 17.02,4.4 24.85,4.4 27.35,6.9 51,6.9 52.6,5.3 v52.6,4.75
5V  (via drill 0.35)
  Top 0.305: v31.51,78.21 33.12,78.21 v33.15,78.24 | v44.95,76.4 50.05,76.4 52.53,73.92 52.53,66.42 D1.A | 43.37,57.15 v44.66,58.44 | VCC.1 43.1,83.8 39.7,83.8 v36.3,80.4
  Top 0.508: v47.5,55 v45.88,53.38 C2.+
  Bottom 0.305: LS1.1 29.45,78.31 29.94,78.8 30.92,78.8 v31.51,78.21 | v33.15,78.24 36.3,78.24 | 36.3,78.24 43.11,78.24 v44.95,76.4 | v44.66,58.44 44.66,57.84 v47.5,55 | 45.65,53.15 v45.88,53.38 | v36.3,80.4 36.3,78.24
  Bottom 0.508: SV1.14 22.44,1.5 52,1.5 53.5,3 53.5,52.5 51,55 | 51,55 v47.5,55 | 45.65,53.15 R1.2 41.3,50.62 IC1.4 | 51,55 51,60.25 D2.C 52.39,61.8 D1.A
9DOF_RESET  (via drill 0.35)
  Top 0.305: 9DOF_RESET.P$1 26.81,95.18 v26.81,93.04 | v24.7,91.49 24.62,86.62 27,84.24 31.77,84.24 Q3.3
  Top 0.406: R15.2 21.49,95.9 9DOF_RESET.P$1
  Bottom 0.305: v26.81,93.04 26.81,92.58 v24.7,91.49
AGND  (via drill 0.35)
  Top 0.406: v39.39,69.11 39.39,78.13 39.62,78.36 39.62,79.92 38.66,80.88 36.73,78.95 36.73,76.12 34.84,73.63 v32.33,73.63 30.38,75.58 v30.38,77.77 | v27.37,75.79 21.61,70.03 15.38,70.03 v14.5,70.91 | v12.52,71.61 11.97,71.61 10.33,73.25 v7.08,73.25 | v4.08,59.87 2.5,58.29 v2.5,58
  Top 0.508: U$1.AGND 1.79,19.21 | 1.79,19.21 1.8,19.2 | v2.5,58 1.6,57.1 v1.6,47.95 | v1.6,43.5 1.6,19.4 1.79,19.21
  Bottom 0.406: 44.5,68 40.5,68 v39.39,69.11 | v30.38,77.77 29.35,77.77 v27.37,75.79 | v14.5,70.91 13.8,71.61 v12.52,71.61 | v7.08,73.25 5.11,73.25 1.56,69.7 1.56,66.86 3.02,65.4 4.7,65.4 4.89,65.21 4.89,60.68 v4.08,59.87
  Bottom 0.508: 44.5,68 46.05,69.56 IC4.6 | v1.6,47.95 v1.6,43.5
BME680_LV_SCK  (via drill 0.35)
  Top 0.305: IC3.4 v15.04,64.42 T2.4
  Bottom 0.305: R9.1 17.12,66.5 v15.04,64.42
BME680_LV_SDI  (via drill 0.35)
  Top 0.305: T2.1 8.5,66.85 v8.8,66.85 | R7.1 18.21,66.77 IC3.3 14.91,65.19 12.11,65.19 11.54,65.76 v11.54,67.18
  Bottom 0.305: v11.54,67.18 9.13,67.18 v8.8,66.85
BME680_SCK
  Top 0.305: T2.3 7.7,64.55 | 7.7,64.55 8.15,64.55 | 7.7,64.55 6.9,64.55 6.85,64.6 6.85,66.55 7.9,67.6 9.75,67.6 R10.1
BME680_SDI
  Top 0.305: R8.1 9.37,66.1 T2.6
ENABLE
  Top 0.406: U2.3 33,89.22 R4.1
FIX  (via drill 0.35)
  Top 0.406: v8.25,59.84 8.37,59.96 9.47,59.96 9.91,60.4 U1.P$5
  Top 0.508: LED1.A 6.04,65.36 v6.15,65.25
  Bottom 0.406: 6.15,63.35 6.15,61.94 v8.25,59.84
  Bottom 0.508: v6.15,65.25 6.15,63.35
GND  (via drill 0.35)
  Top 0.152: U4.7 25.25,60.28 | 25.25,60.28 25.7,60.28 U4.8 U4.9 U4.10 26.97,60.42 27.33,60.78 U4.14 | 25.25,60.28 25.25,60.73 U4.6 U4.5 24.57,61.28 24.3,61.55 24.3,62.95 24.63,63.28 U4.1 25.47,63.55 U4.24 U4.23 U4.22 U4.21 U4.20 28.47,63.55 U4.19
  Top 0.203: U3.3 32.02,64.27 32.52,64.77 U3.12
  Top 0.254: U3.5 30.06,63.27 29.95,63.28 29.27,63.28 | 29.27,63.28 U4.19 | U3.13 U3.12 33.92,64.77 v34.5,65.35 | U3.3 29.77,64.24 28.9,65.25 28.9,65.24 v28.71,66.02 | v27.9,64.65 29.27,63.28
  Top 0.305: IC3.7 14.84,67.57 | IC3.1 15.64,68.37 14.84,67.57 | 5.41,56.01 9.27,56.01 12.91,59.65 U1.P$3 v12.91,63.2 | v25.64,67.67 26.74,68.77 C11.2 28.34,67.69 28.34,66.39 v28.71,66.02 | C13.2 22.06,57.91 v22.43,58.28 22.43,59.03 23.68,60.28 U4.7 | 14.84,67.57 14.94,67.47 v14.94,66.16 | v17.44,78.89 13.84,82.49 v13.39,82.49 | v18.3,82.77 18.52,82.55 v18.43,80.68 | v25.47,78.05 25.28,77.86 v22.5,77.86 | v25.88,73.18 24.47,71.77 v24.47,71.6 | U$1.GND@7 51.1,14.18 51.57,14.18 51.57,17.77 U$1.GND@6 50.13,26.9 51.67,28.44 51.67,36.3 51.04,36.3 U$1.GND@4 | C16.2 41.83,87.77 GND.1 | v45,83.9 45,81.6 46,80.6 47.6,80.6 48.3,81.3 v48.3,82.5 | 35.41,88.04 35.6,87.85 SET.1
  Top 0.406: CAM.1 39.86,96.39 | 39.86,96.39 39.39,95.92 U5.2 39.39,94.43 38.89,93.93 C10.2 38.73,93.01 R3.1 | C12.2 36.41,95.24 37.56,96.39 39.86,96.39 | C16.2 40.45,89.64 R3.1 | U2.2 28.77,88.66 C4.1 30.28,87.8 | 30.28,87.8 Q3.2 32.62,88.04 35.41,88.04 R3.1 | 36.6,60.11 39.41,57.3 40.49,57.3 42.15,55.64 43.53,55.64 | v24.15,81.72 24.36,81.93 v24.36,84.05 | v29.19,85.1 30.28,86.19 30.28,87.8 | v31.26,79.49 v31.27,79.48 C9.2 34.14,77.09 C14.2
  Top 0.508: SV1.1 3.5,3.58 3.5,1.5 16.66,1.5 SV1.12 19.66,4.5 25,4.5 26,5.5 36.08,5.5 MAIN-POWER1.S 39.87,3.9 U$1.GND@0 49.45,10.21 50.13,10.89 U$1.GND@7 | R2.1 36.6,60.11 C1.2 32.21,54.64 CHIP-POWER1.P$2 | U$1.GND@2 33.48,48.13 CHIP-POWER1.P$2 | CHIP-POWER1.P$2 42.14,44.71 C2.- | C3.- 46.31,44.28 C2.- | C2.- 45.88,40.51 U$1.GND@3 49.29,40.21 50.13,39.37 U$1.GND@4 | U1.P$3 12.91,60.04 15.04,57.91 C13.2 | U1.P$8 5.41,56.01 v5.4,53.36 3.91,51.69 U1.P$12 3.91,37.93 U$1.GND@1 | v8.85,50.7 12.6,50.7 14.41,48.89 U1.P$19 | v11.9,78.2 11.77,78.07 B1.- | v12.2,88 12.37,88.17 C17.2 9.78,92.25 Q4.3 | C16.2 45.36,89.64 IC2.1
  Bottom 0.254: v28.71,66.02 28.4,64.65 v27.9,64.65 | v34.5,65.35 34.5,62.04 C15.2
  Bottom 0.305: 25.63,80.24 25.47,80.08 v25.47,78.05 | v25.64,67.67 25.37,67.94 C8.2 25.37,70.7 v24.47,71.6 | v14.94,66.16 14.94,65.69 12.91,63.66 v12.91,63.2 | C5.1 v17.43,78.88 v17.44,78.89 | v13.39,82.49 18.02,82.49 v18.3,82.77 | v18.43,80.68 19.57,81.62 C6.1 | v22.5,77.86 22.5,76.56 v25.88,73.18 | GND.1 43.2,85.7 v45,83.9 | v48.3,82.5 47.33,81.53 IC4.16 | U$20.P$1 4.46,52.42 v5.4,53.36 6.67,53.36 7.21,52.83 U$20.P$2
  Bottom 0.406: C6.1 C7.1 24.05,81.62 v24.15,81.72 25.63,80.24 30.51,80.24 v31.26,79.49 | v24.36,84.05 25.41,85.1 v29.19,85.1
  Bottom 0.508: C15.2 32.29,55.8 C1.2 | U$20.P$2 8.83,50.72 v8.85,50.7 | C5.1 12.58,78.88 v11.9,78.2 | 11.9,87.7 v12.2,88
  pour Top: 0,0 56,0 56,100 0,100
  pour Bottom: 0,0 56,0 56,100 0,100
N$1  (via drill 0.35)
  Top 0.305: C3.+ 48.96,50.78 v47.96,51.78
  Top 0.508: D2.A 39.05,61.72 R2.2
  Bottom 0.305: IC1.1 47.6,51.42 v47.96,51.78 47.96,53.24 46.15,55.05 R1.1
  Bottom 0.508: R1.1 43.83,60.2 D2.A
N$2  (via drill 0.35)
  Top 0.305: LED1.C 2.43,66.89 4.76,69.22 v4.76,69.61 | v11.98,76.81 13.34,78.17 v15.23,78.17 | v19.86,79.16 22.19,81.49 v20.47,89.39 | v34.92,91.21 36.68,91.21 R3.2
  Bottom 0.305: v4.76,69.61 11.96,76.81 v11.98,76.81 | v15.23,78.17 18.87,78.17 v19.86,79.16 | v20.47,89.39 26.85,91.21 v34.92,91.21
N$3
  Top 0.406: FB1.1 27.78,91.86 U2.5
N$4  (via drill 0.35)
  Top 0.305: TX.1 38.1,84.1 v36,82 | v39.3,81.8 40.8,80.3 v40.8,77 | v37.2,75.2 37.2,72.1 v37.1,72 | v44.3,65.1 44.3,61.7 45.9,60.1
  Top 0.508: SV1.4 6.85,4.39 6.85,6.95 2.65,11.15 v2.45,17.95 | U$1.UART2-RX 13.16,42.34 v13.1,42.4 14.3,42.4 v14.35,42.45 | v29.5,52.6 26.55,49.65 v23.55,49.65 v23.54,49.64 v20.7,49.64 | v36.75,52.6 40.75,52.6 v40.8,52.55 | v42.25,59.35 45.15,59.35 45.9,60.1 v48.8,60.1 | v49.05,57.2 49.1,57.15
  Bottom 0.305: v36,82 36.2,81.8 v39.3,81.8 | v40.8,77 39,77 v37.2,75.2 | v37.1,72 37.1,70 39.7,67.4 43.9,67.4 44.3,67 v44.3,65.1
  Bottom 0.508: v2.45,17.95 2.45,41.2 4.3,42.8 12.7,42.8 v13.1,42.4 | v14.35,42.45 16.7,42.45 18.5,44.25 18.5,48.85 19.85,50.2 20.41,49.64 v20.7,49.64 | v29.5,52.6 v36.75,52.6 | v40.8,52.55 41.3,53.05 41.3,58.7 41.95,59.35 v42.25,59.35 | v48.8,60.1 49.05,59.85 v49.05,57.2
N$5  (via drill 0.35)
  Top 0.305: T2.2 T2.5 10.27,65.17 v10.4,65.3 | IC3.8 v14.19,69.54 v14.2,69.55 | v18.6,69.05 18.6,68.26 R7.2 | v13.4,75.94 14.31,75.03 v14.31,73.39 | v11.64,74.87 10.93,74.16 v7.93,74.16 | v5.93,81.77 7.69,83.53 v12.75,83.53 | v22.16,85.48 23.5,83.83 v23.5,82.85 | v48.52,86.17 48.52,84.62 v48.1,84.2
  Top 0.406: IC2.2 48.56,86.21 v48.52,86.17
  Bottom 0.305: v10.4,65.3 11.25,65.29 v14.2,69.55 15.85,71.2 | v18.6,69.05 18.6,69.84 R9.2 18.22,70.98 18,71.2 15.85,71.2 | C5.2 13.24,76.1 v13.4,75.94 12.71,75.94 v11.64,74.87 | v14.31,73.39 14.31,72.74 15.85,71.2 | v7.93,74.16 7.93,79.77 v5.93,81.77 | v12.75,83.53 16.84,83.53 17.55,84.24 17.9,84.24 18.84,83.3 20.12,83.34 v22.16,85.48 | v48.1,84.2 46.98,83.08 46.57,83.08 46.33,82.85 33.84,82.85
  Bottom 0.406: 33.84,82.85 v23.5,82.85 22.65,82.85 C7.2
N$6  (via drill 0.35)
  Top 0.305: v34.9,84 34.9,82.5 35.3,82.1 35.3,81.8 35.3,77.3 v35.7,76.9 | v34.7,72.4 34.7,72 v35.9,70.8 | v38.2,67.4 36.2,65.4 v36.2,63.7
  Top 0.508: U$1.UART2-TX 15.7,43.3 v15.5,43.5 16.45,43.5 17.5,44.55 17.5,48.4 19.6,50.5 25.55,50.5 v29.45,54.4 | v34.35,54.65 35.4,53.6 44.03,53.6
  Bottom 0.305: RX.1 38.2,84 v34.9,84 | v35.7,76.9 35.7,73.4 v34.7,72.4 | v35.9,70.8 35.9,70.5 38.2,68.2 v38.2,67.4 | v36.2,63.7 36.2,56.5 v34.35,54.65
  Bottom 0.508: v15.5,43.5 15,44 4,44 1.5,41.5 1.5,7.2 SV1.2 | v34.35,54.65 34.1,54.4 v29.45,54.4
N$7
  Top 0.508: B1.+$2 2.48,80.94 D4.A 3.75,78.44 3.75,73.94 B1.+$1
N$8  (via drill 0.35)
  Top 0.305: v29.1,74 28.93,73.83 28.27,73.83 26.52,72.08 v26.52,71.21 | v26.51,64.56 25.21,64.56 v25,64.77
  Top 0.406: FB1.2 24.01,86.43 26.68,83.81 v29.75,81.54 | v32.65,81.07 33.83,81.07 C9.1
  Top 0.508: R5.1 17.2,62.19 | 17.2,62.19 16.49,62.19 U1.P$1 | v21.44,67.68 17.32,65.25 17.2,62.19
  Bottom 0.305: v32.65,81.07 32.36,80.78 32.36,77.26 v29.1,74 | v26.52,71.21 v26.52,64.57 v26.51,64.56 | v25,64.77 25,67.13 22.75,69.37
  Bottom 0.406: v29.75,81.54 32.18,81.54 v32.65,81.07
  Bottom 0.508: C8.1 22.75,69.37 21.53,67.68 v21.44,67.68
N$9  (via drill 0.35)
  Top 0.406: v2.55,47.39 2.55,45.75 U1.P$11
  Bottom 0.406: U$20.P$3 4.03,47.39 v2.55,47.39
N$10  (via drill 0.35)
  Top 0.508: BREAKOUT.4 22.95,45.02 28.5,45.02 30.59,47.11 30.59,58.7 v30.82,58.93 | v30.99,68.88 35.36,68.88 38.67,72.19 v38.67,79.25
  Bottom 0.508: v30.82,58.93 30.82,68.71 v30.99,68.88 | v38.67,79.25 39.81,80.39 IC4.11
N$11  (via drill 0.35)
  Top 0.152: U4.16 27.32,61.78 v27.05,62.05 | C11.1 26.59,66.2 v25.7,66.2
  Bottom 0.152: v25.7,66.2 25.7,63.4 v27.05,62.05
N$12
  Top 0.508: CHIP-POWER1.P$1 36.02,44.17 U$1.PWRON
N$14
  Top 0.508: Q4.2 10.9,88.3 10.9,86.55 19.14,78.31 LS1.2
N$15
  Top 0.508: BAT1.2 49.82,2.2 37.04,2.2 MAIN-POWER1.P
N$16  (via drill 0.35)
  Top 0.508: U$1.CSID0 28.32,7.75 v41.55,7.75 | v50.5,40.7 48.8,42.4 v48.8,42.85 | v48.45,54 48.4,54.05 v48.4,55.8
  Bottom 0.305: 38.65,63.4 26.01,76.04 25.93,76.13 23.47,78.71 23.47,79.76 23.01,80.22 20.74,80.22 20.48,79.96 9.59,79.96 9.55,80
  Bottom 0.508: v41.55,7.75 50.05,7.75 52.5,10.2 52.5,38.7 v50.5,40.7 | v48.8,42.85 48.8,43.9 49.1,44.2 49.1,53.35 v48.45,54 | v48.4,55.8 44.67,59.55 44.65,62.25 43.5,63.4 38.65,63.4 | Q4.1 4.41,85.14 9.55,80
N$18
  Top 0.508: U$1.CSID1 23.32,5.7 SV1.15
N$19  (via drill 0.35)
  Top 0.508: BAT1.1 53.5,7.68 53.5,40.05 v51.8,41.75 | v29.5,41.55 28.4,40.45 U$1.BAT
  Bottom 0.508: v51.8,41.75 29.7,41.75 v29.5,41.55
N$20
  Top 0.508: U$1.CSID2 20.78,5.7 SV1.13
N$21
  Top 0.508: U$1.CSID3 18.24,5.7 SV1.11
N$22
  Top 0.508: U$1.CSID4 15.7,5.7 SV1.9
N$23
  Top 0.508: U$1.CSID5 13.16,5.7 SV1.7
N$24  (via drill 0.35)
  Top 0.203: v29.06,66.99 29.29,66.99 30.17,66.11 30.17,64.83 30.23,64.77 U3.2
  Top 0.406: C14.1 33.73,74.72 v32.76,74.72 | v29.98,73.19 28.52,73.19 27.05,71.72 27.45,71.32 v27.48,71.32
  Bottom 0.203: v27.48,71.32 29.06,69.74 v29.06,66.99
  Bottom 0.406: v32.76,74.72 33.57,73.91 33.57,72.47 30.7,72.47 v29.98,73.19
N$25
  Top 0.508: U$1.CSID6 10.62,5.7 SV1.5
N$26  (via drill 0.35)
  Top 0.254: U3.8 32.75,62.8 v33.39,62.3 | v32.15,61.15 34.75,61.15 v34.95,61.35
  Bottom 0.254: v33.39,62.3 32.15,61.2 v32.15,61.15 | v34.95,61.35 34.19,60.59 C15.1
N$27
  Top 0.508: U$1.CSID7 8.08,5.7 SV1.3
OUT  (via drill 0.35)
  Top 0.152: U4.18 U4.17
  Top 0.254: v23.6,55.5 23.6,56.78 R12.2 | U3.1 30.98,66.17 31.5,66.7 32.6,66.7 v32.75,66.75 | v32.75,66.75 U3.14 | v32.75,66.75 34.15,66.75 35.2,65.7 35.25,63.85 | 35.25,63.85 34.17,63.77 U3.10 | U3.7 32.25,62.25 32.9,61.6 33.6,61.6 35.25,63.1 35.25,63.85 | U4.18 29.62,62.78 v29.8,62.6 29.8,61.7 | 29.8,61.7 29.38,61.28 U4.15 | 29.8,61.7 29.8,60.8 29.28,60.28 U4.13
  Top 0.305: Q1.1 19.53,55.87 C13.1 20.18,55.5 v23.6,55.5 | v31.42,58.15 33.37,60.1 35.29,60.1 35.64,60.45 35.64,62.71 35.25,63.1 | C12.1 33.93,98.54 20.23,98.54 14.69,93 14.69,90.63 15.45,89.87 | 15.45,89.87 R15.1 | 15.45,89.87 15.45,88.16 | 15.45,88.16 15.45,87.86 C17.1 | 15.45,88.16 15.51,88.22 R11.2 20.4,85.18 v19.88,80.8 | v22.58,79.45 23.26,80.85 v23.33,80.85
  Top 0.406: C12.1 36.01,97.82 U5.5
  Bottom 0.254: Q2.1 23.62,55.48 v23.6,55.5
  Bottom 0.305: Q2.1 24.51,55.14 24.51,55.89 26.71,58.09 29.29,58.09 | 29.29,58.09 29.8,58.6 v29.8,62.6 | 29.29,58.09 31.36,58.09 v31.42,58.15 | v32.75,66.75 31.85,67.65 31.85,69.12 26.84,74.13 26.9,74.39 22.33,79.16 v22.58,79.45 | v23.33,80.85 19.93,80.85 v19.88,80.8
RST_3V  (via drill 0.35)
  Top 0.254: U4.4 25.76,61.78 v26.21,61.33 | v24.21,64.26 22.96,65.93 22.92,69.02 27.46,73.67 v28.41,74.78
  Top 0.406: Q3.1 33.23,82.86 29.47,79.1 v29.47,76.07
  Bottom 0.254: v26.21,61.33 24.46,63.08 v24.21,64.26
  Bottom 0.406: v29.47,76.07 28.41,75.01 v28.41,74.78
RX  (via drill 0.35)
  Top 0.508: D3.C 51.13,72.6 v51.13,72.57
  Bottom 0.508: v51.13,72.57 IC4.2
RX_3V  (via drill 0.35)
  Top 0.305: v19.56,59.06 20.79,59.06 22.01,60.28 22.87,60.28 23.32,60.73 23.32,62.7 v22.83,63.25
  Top 0.406: D3.A 46.64,73.41 v41.74,73.41 | v38.35,70.2 35.9,67.65 29.5,67.65 29.5,69.47 28.58,70.39 26.64,70.39 24.09,67.84 v24.09,66.9 | R5.2 18.68,64.09 v18.04,63.41 | v1.69,59.27 1.69,60.89 U1.P$10
  Bottom 0.305: v18.04,63.41 18.02,61.87 19.11,60.78 19.74,60.78 20.07,60.45 20.07,59.31 19.82,59.06 v19.56,59.06 | v38.35,70.2 38.35,71.86 39.9,73.41
  Bottom 0.406: 39.9,73.41 v41.74,73.41 | v24.09,66.9 22.78,65.59 v22.83,63.25 | v18.04,63.41 14.97,63.41 10.59,59.03 1.93,59.03 v1.69,59.27
SCL  (via drill 0.35)
  Top 0.508: v19.65,65.4 21.45,65.4 21.44,65.29 v21.44,64.6 | v21.65,42.8 21.65,41.08 U$1.TWI1-SCK | SV1.6 11.95,4.41 v11.95,7.55 | v49.05,8.65 50.85,8.65 52.45,10.25 52.45,39.9 v51.65,40.7 | v51.35,47.2 46.5,47.2 42.65,51.05 | 42.65,51.05 38.8,51.05 v38,50.25 | 42.65,51.05 42.65,52.01 v42.08,52.58 | v42.97,58.48 40.99,58.48 v40.38,59.09 | v40.57,62.57 40.57,74.75 44.39,78.57 v49.08,78.57 | CAM.4 49.86,93.49 v49.86,82.19
  Bottom 0.508: R14.1 19.65,71.21 v19.65,65.4 | v21.44,64.6 21.55,53.45 22.75,52.25 22.8,52.25 | 22.8,52.25 Q2.3 | 22.8,52.25 21.65,51.1 v21.65,42.8 30.55,42.8 v38,50.25 | v11.95,7.55 13.05,8.65 v49.05,8.65 | v51.65,40.7 51.9,40.7 52.75,41.55 52.75,45.8 v51.35,47.2 | v42.08,52.58 42.08,57.59 v42.97,58.48 | v40.38,59.09 40.38,62.38 v40.57,62.57 | v49.08,78.57 49.87,79.36 IC4.18 v49.86,82.19
SCL_3V  (via drill 0.35)
  Top 0.152: R12.1 27.47,58.75 U4.11
  Top 0.254: v25.6,55.5 25.58,55.52 R12.1 25.58,57.02 v24.53,58.32 | U3.4 29.54,63.79 28.21,65.43 v24.25,65.56
  Bottom 0.254: v25.6,55.5 25.6,54.33 Q2.2
  Bottom 0.305: v24.25,65.56 23.53,64.5 23.51,61.64 24.53,60.56 v24.53,58.32
SDA  (via drill 0.35)
  Top 0.406: v28.49,71.26 31.13,72.01 v32.27,70.87
  Top 0.508: v20.5,51.5 20.25,51.75 Q1.3 17.13,50.3 v14.95,50.3 | v2.6,43.95 2.6,37 v3.36,36.24 | v18.35,42.75 18.24,42.64 U$1.TWI1-SDA | v19.93,1.48 52.06,1.48 v54.42,3.84
  Bottom 0.406: R13.1 27.89,72.21 v28.49,71.26 | v32.27,70.87 34.77,70.87 39.08,75.18 54.42,75.08
  Bottom 0.508: R13.1 20.64,51.64 v20.5,51.5 | v14.95,50.3 8.94,49.8 v2.6,43.95 | v3.36,36.24 3.4,39.2 4.75,40.55 16.15,40.55 v18.35,42.75 | SV1.8 14.84,1.48 v19.93,1.48 | v54.42,3.84 54.42,75.08 54.42,78.38 IC4.20 54.16,82.15 54.16,85.96 50.22,89.9 CAM.3
SDA_3V  (via drill 0.35)
  Top 0.254: U3.6 31.3,62.55 31.3,60.7 29.7,59.1 v28.3,59.1 27.97,59.43 U4.12
  Top 0.305: Q1.2 18.03,54.15 v18.03,56.56 | v18.98,59.92 20.54,61 22.19,61 | 22.19,61 v22.62,61 | v23.38,58.17 24.39,59.54 24.77,59.16 25.58,59.16 v26.04,58.7 | R11.1 17.36,85.88 v19.09,84.15 | v22.24,87.24 23.62,85.93 26.28,83.27 26.28,78.15 v26.41,78.02 | v26.66,76.36 v21.7,71.4 v21.69,71.4 | v21.49,69.25 22.06,68.68 22.14,68.68 22.14,61.05 22.19,61
  Bottom 0.305: v18.03,56.56 18.03,58.49 v18.98,59.92 | v22.62,61 23.33,60.41 v23.38,58.17 | v26.04,58.7 27.9,58.7 v28.3,59.1 | v19.09,84.15 20.87,85.93 v22.24,87.24 | v26.41,78.02 26.66,77.77 v26.66,76.36 | v21.69,71.4 21.69,69.45 v21.49,69.25
TX  (via drill 0.35)
  Top 0.305: v3.43,66.7 3.43,64.48 v3.54,64.37 | v1.4,62.95 3.53,62.95 3.91,62.57 U1.P$9
  Top 0.508: v34.28,70.03 27.15,77.16 v19.44,77.01
  Bottom 0.305: v3.54,64.37 2.12,62.95 v1.4,62.95
  Bottom 0.508: IC4.1 52.41,69.34 47.24,64.18 39.66,64.18 v34.28,70.03 | v19.44,77.01 16.34,77.01 6.03,66.7 v3.43,66.7
VBACKUP
  Top 0.508: D4.C 2.48,68.03 1.4,66.95 1.4,64.2 2.07,63.53 10.6,63.5 11.41,62.69 U1.P$4

### Text on the board
tPlace: GWC Cansat 2018
bPlace: GWC Cansat 2018